# EAGLE design 17323^0 (EAGLE 7.6.0)
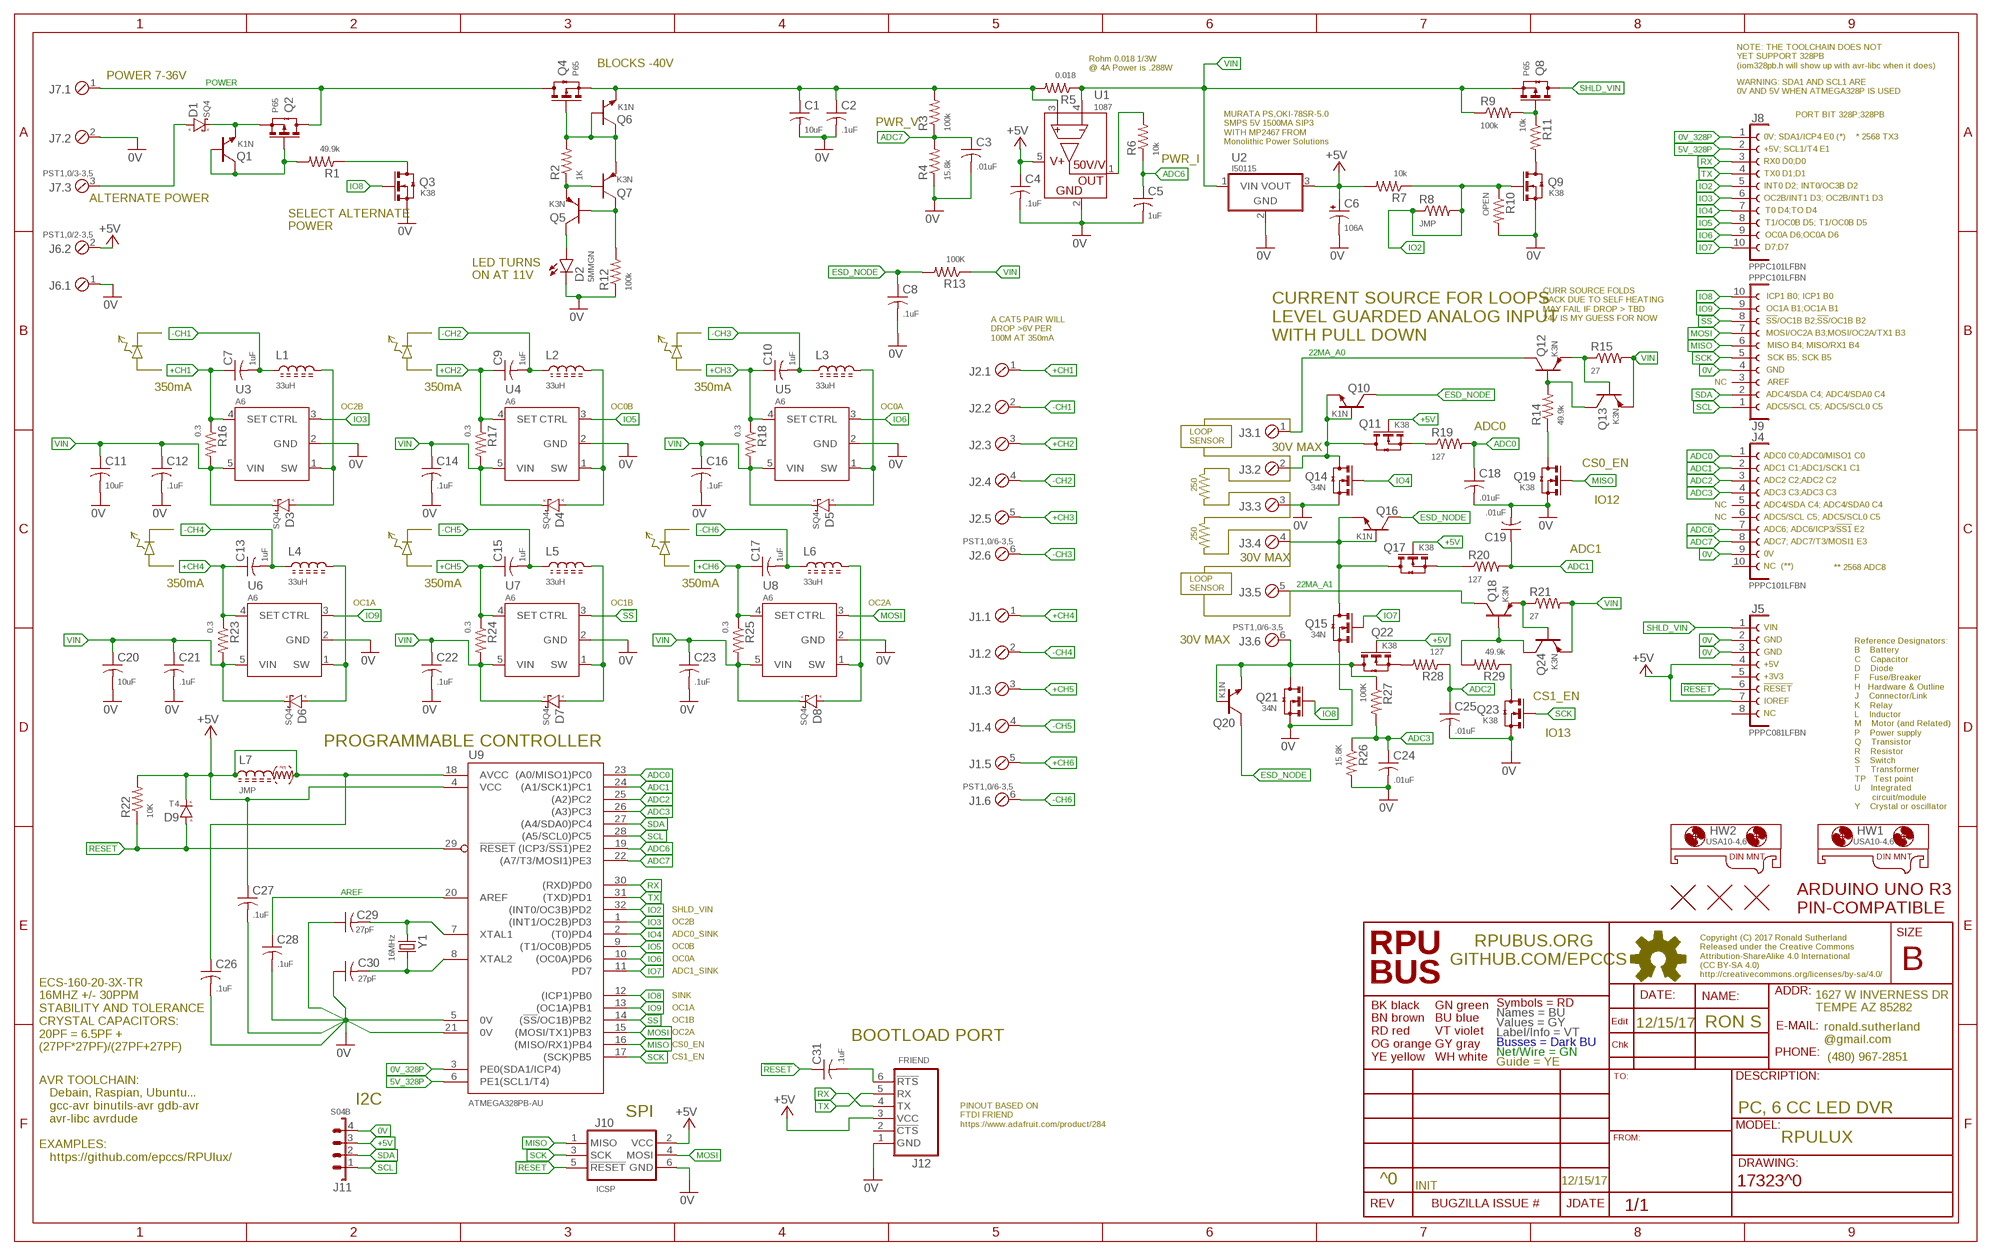
[diagram p0: schematic, sheet 1]

## Parts
C1  10uF  CC1206  [C1206(3216)]
C2  .1uF  CC0805A  [C0805(2012)]
C3  .01uF  CC0603A  [C0603(1608)]
C4  .1uF  CC0603A  [C0603(1608)]
C5  1uF  CC0805A  [C0805(2012)]
C6  106A  CT1206  [3216]
C7  1uF  CC0805A  [C0805(2012)]
C8  .1uF  CC0603A  [C0603(1608)]
C9  1uF  CC0805A  [C0805(2012)]
C10  1uF  CC0805A  [C0805(2012)]
C11  10uF  CC1206  [C1206(3216)]
C12  .1uF  CC0603A  [C0603(1608)]
C13  1uF  CC0805A  [C0805(2012)]
C14  .1uF  CC0603A  [C0603(1608)]
C15  1uF  CC0805A  [C0805(2012)]
C16  .1uF  CC0603A  [C0603(1608)]
C17  1uF  CC0805A  [C0805(2012)]
C18  .01uF  CC0603A  [C0603(1608)]
C19  .01uF  CC0603A  [C0603(1608)]
C20  10uF  CC1206  [C1206(3216)]
C21  .1uF  CC0603A  [C0603(1608)]
C22  .1uF  CC0603A  [C0603(1608)]
C23  .1uF  CC0603A  [C0603(1608)]
C24  .01uF  CC0603A  [C0603(1608)]
C25  .01uF  CC0603A  [C0603(1608)]
C26  .1uF  CC0603A  [C0603(1608)]
C27  .1uF  CC0603A  [C0603(1608)]
C28  .1uF  CC0603A  [C0603(1608)]
C29  27pF  CC0603A  [C0603(1608)]
C30  27pF  CC0603A  [C0603(1608)]
C31  .1uF  CC0603A  [C0603(1608)]
D1  SQ4  DSMA  [SMA]
D2  5MMGN  LED5MM  [LED5MM]
D3  SQ4  DSMA  [SMA]
D4  SQ4  DSMA  [SMA]
D5  SQ4  DSMA  [SMA]
D6  SQ4  DSMA  [SMA]
D7  SQ4  DSMA  [SMA]
D8  SQ4  DSMA  [SMA]
D9  T4  DSOD123  [SOD123]
HW1  USA10-4,6  MOUNT-HOLE5.0  [USA10]
HW2  USA10-4,6  MOUNT-HOLE5.0  [USA10]
J1  PST1,0/6-3,5  MCV6  [MCV6]
J2  PST1,0/6-3,5  MCV6  [MCV6]
J3  PST1,0/6-3,5  MCV6  [MCV6]
J4  PPPC101LFBN  F1X10  [F1X10]
J5  PPPC081LFBN  F1X8  [F1X8]
J6  PST1,0/2-3,5  MCV2  [MCV2]
J7  PST1,0/3-3,5  MCV3  [MCV3]
J8  PPPC101LFBN  F1X10  [F1X10]
J9  PPPC101LFBN  F1X10  [F1X10]
J10  ICSP  ISP-SPIPTH  [ISP]
J11  S04B  B04B  [B04B]
J12  FRIEND  [FRIEND]
L1  33uH  L2424  [L2424]
L2  33uH  L2424  [L2424]
L3  33uH  L2424  [L2424]
L4  33uH  L2424  [L2424]
L5  33uH  L2424  [L2424]
L6  33uH  L2424  [L2424]
L7  JMP  L0805  [C0805(2012)]
Q1  K1N  NPNSOT23  [SOT23]
Q2  P65  N-CHSOT23  [SOT23]
Q3  K38  N-CHSOT23  [SOT23]
Q4  P65  N-CHSOT23  [SOT23]
Q5  K3N  PNPSOT23  [SOT23]
Q6  K1N  NPNSOT23  [SOT23]
Q7  K3N  PNPSOT23  [SOT23]
Q8  P65  N-CHSOT23  [SOT23]
Q9  K38  N-CHSOT23  [SOT23]
Q10  K1N  NPNSOT23  [SOT23]
Q11  K38  N-CHSOT23  [SOT23]
Q12  K3N  PNPSOT23  [SOT23]
Q13  K3N  PNPSOT23  [SOT23]
Q14  34N  N-CHSOT23  [SOT23]
Q15  34N  N-CHSOT23  [SOT23]
Q16  K1N  NPNSOT23  [SOT23]
Q17  K38  N-CHSOT23  [SOT23]
Q18  K3N  PNPSOT23  [SOT23]
Q19  K38  N-CHSOT23  [SOT23]
Q20  K1N  NPNSOT23  [SOT23]
Q21  34N  N-CHSOT23  [SOT23]
Q22  K38  N-CHSOT23  [SOT23]
Q23  K38  N-CHSOT23  [SOT23]
Q24  K3N  PNPSOT23  [SOT23]
R1  49.9k  R0805  [C0805(2012)]
R2  1K  R0805  [C0805(2012)]
R3  100k  R0805  [C0805(2012)]
R4  15.8k  R0805  [C0805(2012)]
R5  0.018  R1210  [C1210(3225)]
R6  10k  R0805  [C0805(2012)]
R7  10k  R0805  [C0805(2012)]
R8  JMP  R0805  [C0805(2012)]
R9  100k  R0805  [C0805(2012)]
R10  OPEN  R0805  [C0805(2012)]
R11  10k  R0805  [C0805(2012)]
R12  100k  R0805  [C0805(2012)]
R13  100K  R0805  [C0805(2012)]
R14  49.9k  R0805  [C0805(2012)]
R15  27  R0805  [C0805(2012)]
R16  0.3  R1210  [C1210(3225)]
R17  0.3  R1210  [C1210(3225)]
R18  0.3  R1210  [C1210(3225)]
R19  127  R0805  [C0805(2012)]
R20  127  R0805  [C0805(2012)]
R21  27  R0805  [C0805(2012)]
R22  10K  R0805  [C0805(2012)]
R23  0.3  R1210  [C1210(3225)]
R24  0.3  R1210  [C1210(3225)]
R25  0.3  R1210  [C1210(3225)]
R26  15.8K  R0805  [C0805(2012)]
R27  100K  R0805  [C0805(2012)]
R28  127  R0805  [C0805(2012)]
R29  49.9k  R0805  [C0805(2012)]
U1  1087  ZXCT1087  [SOT23-5]
U2  I50115  OKI-78SR-H  [OKI-78SR-H]
U3  A6  AL8805  [SOT23-5]
U4  A6  AL8805  [SOT23-5]
U5  A6  AL8805  [SOT23-5]
U6  A6  AL8805  [SOT23-5]
U7  A6  AL8805  [SOT23-5]
U8  A6  AL8805  [SOT23-5]
U9  ATMEGA328PB-AU  [TQFP32-08]
U$1  ARDUINO-UNO  [ARDUINO_UNO]
U$2  FIDUCIAL1.27  [FIDUCIAL-1.27]
U$3  FIDUCIAL1.27  [FIDUCIAL-1.27]
U$4  FIDUCIAL1.27  [FIDUCIAL-1.27]
Y1  16MHz  CSM-3X  [CSM-3X]

## Nets
0V: C1.2 C2.2 C3.2 C4.2 C5.2 C6.- C8.2 C11.2 C12.2 C14.2 C16.2 C18.2 C19.2 C20.2 C21.2 C22.2 C23.2 C24.2 C25.2 C26.2 C27.2 C28.2 C29.1 C30.1 D2.K J3.3 J4.9 J5.2 J5.3 J6.1 J7.2 J9.4 J10.6(GND) J11.4 J12.1(GND) Q3.2(S)(S) Q9.2(S)(S) Q14.2(S)(S) Q15.2(S)(S) Q19.2(S)(S) Q21.2(S)(S) Q23.2(S)(S) R4.1 R10.2 R12.1 R26.2 U1.2(GND) U2.2(GND) U3.2(GND) U4.2(GND) U5.2(GND) U6.2(GND) U7.2(GND) U8.2(GND) U9.5(0V) U9.21(0V)
0V_328P: J8.1 U9.3(PE0(SDA1/ICP4))
5V_328P: J8.2 U9.6(PE1(SCL1/T4))
22MA_A0: J3.1 Q12.C
22MA_A1: J3.5 Q18.C
!RESET!: C31.1 D9.A J5.6 J10.5(!RESET) R22.1 U9.29(!RESET)
!SS: J9.8 U7.3(CTRL) U9.14((!SS!/OC1B)PB2)
+5V: C4.1 C6.+ C26.1 C27.1 D9.C(K) J5.4 J5.7 J6.2 J10.2(VCC) J11.3 J12.3(VCC) L7.1 L7.2 Q11.1(G)(G) Q17.1(G)(G) Q22.1(G)(G) R7.2 R22.2 U1.5(VCC) U2.3(VOUT) U9.4(VCC) U9.18(AVCC)
+CH1: C7.1 J2.1 R16.1 U3.4(SET)
+CH2: C9.1 J2.3 R17.1 U4.4(SET)
+CH3: C10.1 J2.5 R18.1 U5.4(SET)
+CH4: C13.1 J1.1 R23.1 U6.4(SET)
+CH5: C15.1 J1.3 R24.1 U7.4(SET)
+CH6: C17.1 J1.5 R25.1 U8.4(SET)
-CH1: C7.2 J2.2 L1.1
-CH2: C9.2 J2.4 L2.1
-CH3: C10.2 J2.6 L3.1
-CH4: C13.2 J1.2 L4.1
-CH5: C15.2 J1.4 L5.1
-CH6: C17.2 J1.6 L6.1
ADC0: C18.1 J4.1 R19.2 U9.23((A0/MISO1)PC0)
ADC1: C19.1 J4.2 R20.2 U9.24((A1/SCK1)PC1)
ADC2: C25.1 J4.3 R28.1 U9.25((A2)PC2)
ADC3: C24.1 J4.4 R26.1 R27.2 U9.26((A3)PC3)
ADC6: C5.1 J4.7 R6.1 U9.19((ICP3/!SS1!)PE2)
ADC7: C3.1 J4.8 R3.1 R4.2 U9.22((A7/T3/MOSI1)PE3)
AREF: C28.1 U9.20(AREF)
ESD_NODE: C8.1 Q10.C Q16.C Q20.C R13.2
IO2: J8.5 Q9.1(G)(G) R7.1 R8.1 R8.2 R10.1 U9.32((INT0/OC3B)PD2)
IO3: J8.6 U3.3(CTRL) U9.1((INT1/OC2B)PD3)
IO4: J8.7 Q14.1(G)(G) U9.2((T0)PD4)
IO5: J8.8 U4.3(CTRL) U9.9((T1/OC0B)PD5)
IO6: J8.9 U5.3(CTRL) U9.10((OC0A)PD6)
IO7: J8.10 Q15.1(G)(G) U9.11(PD7)
IO8: J9.10 Q3.1(G)(G) Q21.1(G)(G) U9.12((ICP1)PB0)
IO9: J9.9 U6.3(CTRL) U9.13((OC1A)PB1)
MISO: J9.6 J10.1(MISO) Q19.1(G)(G) U9.16((MISO/RX1)PB4)
MOSI: J9.7 J10.4(MOSI) U8.3(CTRL) U9.15((MOSI/TX1)PB3)
N$1: Q22.2(S)(S) R28.2
N$2: Q8.1(G)(G) R9.2 R11.1
N$3: D3.A L1.2 U3.1(SW)
N$4: Q9.3(D)(D) R11.2
N$5: Q5.B Q7.C R12.2
N$6: Q4.1(G)(G) Q6.B Q6.C Q7.E R2.2
N$7: D2.A Q5.C
N$8: R6.2 U1.1(OUT)
N$9: J3.6 Q20.B Q20.E Q21.3(D)(D) Q22.3(D)(D) R27.1
N$10: Q5.E Q7.B R2.1
N$11: D6.A L4.2 U6.1(SW)
N$12: J3.4 Q15.3(D)(D) Q16.B Q16.E Q17.3(D)(D)
N$13: Q17.2(S)(S) R20.1
N$14: Q11.2(S)(S) R19.1
N$15: J3.2 Q10.B Q10.E Q11.3(D)(D) Q14.3(D)(D)
N$16: D4.A L2.2 U4.1(SW)
N$17: D7.A L5.2 U7.1(SW)
N$18: D5.A L3.2 U5.1(SW)
N$19: Q23.3(D)(D) R29.1
N$20: Q12.E Q13.B R15.1
N$21: Q19.3(D)(D) R14.1
N$22: D8.A L6.2 U8.1(SW)
N$23: Q12.B Q13.C R14.2
N$24: D1.A J7.3
N$25: C31.2 J12.6(!RTS)
N$28: Q18.E Q24.B R21.1
N$29: Q18.B Q24.C R29.2
N$32: D1.K Q1.E Q2.2(S)(S)
N$33: Q1.B Q1.C Q2.1(G)(G) R1.2
N$34: Q3.3(D)(D) R1.1
N$115: C29.2 U9.7(XTAL1) Y1.1
N$116: C30.2 U9.8(XTAL2) Y1.2
POWER: J7.1 Q2.3(D)(D) Q4.3(D)(D)
RX: J8.3 J12.4(TX) U9.30((RXD)PD0)
SCK: J9.5 J10.3(SCK) Q23.1(G)(G) U9.17((SCK)PB5)
SCL: J9.1 J11.1 U9.28((A5/SCL0)PC5)
SDA: J9.2 J11.2 U9.27((A4/SDA0)PC4)
SHLD_VIN: J5.1 Q8.3(D)(D)
TX: J8.4 J12.5(RX) U9.31((TXD)PD1)
VIN: C11.1 C12.1 C14.1 C16.1 C20.1 C21.1 C22.1 C23.1 D3.K D4.K D5.K D6.K D7.K D8.K Q8.2(S)(S) Q13.E Q24.E R5.1 R9.1 R13.1 R15.2 R16.2 R17.2 R18.2 R21.2 R23.2 R24.2 R25.2 U1.4(S-) U2.1(VIN) U3.5(VIN) U4.5(VIN) U5.5(VIN) U6.5(VIN) U7.5(VIN) U8.5(VIN)
VIN_S: C1.1 C2.1 Q4.2(S)(S) Q6.E R3.2 R5.2 U1.3(S+)
Unconnected: J4.5 J4.6 J4.10 J5.5 J5.8 J9.3 J12.2(!CTS)

## Notes on the sheet
- BLOCKS -40V
- NOTE: THE TOOLCHAIN DOES NOT 
  YET SUPPORT 328PB
  (iom328pb.h will show up with avr-libc when it does)
- Rohm 0.018 1/3W
  @ 4A Power is .288W
- POWER 7-36V
- WARNING: SDA1 AND SCL1 ARE 
  0V AND 5V WHEN ATMEGA328P IS USED
- PORT BIT 328P;328PB
- PWR_V
- 0V; SDA1/ICP4 E0 (*) | * 2568 TX3
- MURATA PS,OKI-78SR-5.0
  SMPS 5V 1500MA SIP3
  WITH MP2467 FROM 
  Monolithic Power Solutions
- +5V; SCL1/T4 E1
- PWR_I | RX0 D0;D0
- TX0 D1;D1
- INT0 D2; INT0/OC3B D2
- ALTERNATE POWER | OC2B/INT1 D3; OC2B/INT1 D3
- T0 D4;TO D4
- T1/OC0B D5; T1/OC0B D5
- SELECT ALTERNATE
  POWER
- OC0A D6;OC0A D6
- D7;D7
- LED TURNS 
  ON AT 11V
- ICP1 B0; ICP1 B0
- OC1A B1;OC1A B1
- CURR SOURCE FOLDS 
  BACK DUE TO SELF HEATING 
  MAY FAIL IF DROP > TBD 
  24V IS MY GUESS FOR NOW
- !SS!/OC1B B2;!SS!/OC1B B2
- MOSI/OC2A B3;MOSI/OC2A/TX1 B3
- A CAT5 PAIR WILL
  DROP >6V PER 
  100M AT 350mA
- CURRENT SOURCE FOR LOOPS
  LEVEL GUARDED ANALOG INPUT 
  WITH PULL DOWN
- MISO B4; MISO/RX1 B4
- SCK B5; SCK B5
- GND
- NC | AREF
- 350mA | 350mA | 350mA
- ADC4/SDA C4; ADC4/SDA0 C4
- OC2B | OC0B | OC0A | ADC5/SCL C5; ADC5/SCL0 C5
- ADC0
- LOOP 
  SENSOR
- 30V MAX
- ADC0 C0;ADC0/MISO1 C0
- CS0_EN
- ADC1 C1;ADC1/SCK1 C1
- ADC2 C2;ADC2 C2
- 250
- ADC3 C3;ADC3 C3
- IO12
- NC | ADC4/SDA C4; ADC4/SDA0 C4
- NC | ADC5/SCL C5; ADC5/SCL0 C5
- ADC6; ADC6/ICP3/!SS1! E2
- 250
- ADC7; ADC7/T3/MOSI1 E3
- ADC1
- 0V
- 30V MAX
- NC  (**) | ** 2568 ADC8
- 350mA | 350mA | 350mA
- LOOP 
  SENSOR
- OC1A | OC1B | OC2A
- VIN
- 30V MAX | GND
- GND
- +5V
- +3V3
- !RESET
- CS1_EN
- IOREF
- NC
- IO13
- PROGRAMMABLE CONTROLLER
- SHLD_VIN
- OC2B
- ADC0_SINK
- OC0B
- OC0A
- ADC1_SINK
- SINK
- OC1A
- OC1B
- 12/15/17 | RON S
- OC2A
- BOOTLOAD PORT
- CS0_EN
- ECS-160-20-3X-TR
  16MHZ +/- 30PPM
  STABILITY AND TOLERANCE
  CRYSTAL CAPACITORS:
  20PF = 6.5PF +
  (27PF*27PF)/(27PF+27PF)
- CS1_EN
- I2C
- SPI | PC, 6 CC LED DVR
- PINOUT BASED ON
  FTDI FRIEND
  https://www.adafruit.com/product/284
- RPULUX
- AVR TOOLCHAIN: 
     Debain, Raspian, Ubuntu...
     gcc-avr binutils-avr gdb-avr 
     avr-libc avrdude
  
  EXAMPLES:
     https://github.com/epccs/RPUlux/
- ^0 | 12/15/17
- INIT

## Library data of the parts
C1-C5 C7-C31 = C-C:C: CAPACITOR Symbol
C6 = C-T:CT: Tantalum Electrolytic Capacitor
D1 D3-D8 = D-SBR:D: DIODE
D2 = D-LED:LED: LED 120120WH [CREE,XHGAWT-00-0000-00000HXE1] LED WHITE 6500K 150LUM-W120120
D9 = D-GP:D: DIODE
HW1 HW2 = HW-DINMnt:MOUNT-HOLE: USA10-4.6 [PhxCont,1202713] DINRAIL ADAPTER UNIVERSAL 10MM 4.6MM
J1-J3 = J-HDR3.5mm:MCV6: MCV 1,5/6-G-3,5 [PHOENIX CONTACT,1843648] CONN HEADER SHROUDED 6POS 3.5MM MCVR 1,5/6-ST-3,5 [PHOENIX CONTACT,1863194] CONN PLUG 6POS SCREW 3.5MM PST 1,0/6-3,5 [PHOENIX CONTACT,1945135] CONN HEADER STRIP PIN 6POS 3.5MM PT 1,5/6-PVH-3,5 [PHOENIX CONTACT,1984057] CONN PLUG STRIP 6POS 3.5MM Drill Size 3/64": .0469" (1.2mm)
J4 J8 J9 = J-HDR2.54mm:F1X10: FEMALE HEADER 10POS
J5 = J-HDR2.54mm:F1X8: FEMALE HEADER 8POS
J6 = J-HDR3.5mm:MCV2: MCV 1,5/ 2-G-3,5-RN [PHOENIX CONTACT,1731471] CONN HEADER SHROUDED 2POS 3.5MM MCVR 1,5/ 2-ST-3,5 [PHOENIX CONTACT,1863152] CONN PLUG 2POS SCREW 3.5MM PST 1,0/2-3,5 [PHOENIX CONTACT,1945096] CONN HEADER STRIP PIN 2POS 3.5MM PT1,5/2-PVH-3,5 [PHOENIX CONTACT,1984015] CONN PLUG STRIP 2POS 3.5MM
J7 = J-HDR3.5mm:MCV3: MCV 1,5/ 3-G-3,5-RN [PHOENIX CONTACT,1731484] CONN HEADER SHROUDED 3POS 3.5MM MCVR 1,5/ 3-ST-3,5 [PHOENIX CONTACT,1863165] CONN PLUG 3POS SCREW 3.5MM PST 1,0/3-3,5 [PHOENIX CONTACT,1945106] CONN HEADER STRIP PIN 3POS 3.5MM PT1,5&3-PVH-3,5 [PHOENIX CONTACT,1984028] CONN PLUG STRIP 3POS 3.5MM
J10 = U-AVR:ISP-SPI: AVR ISP thru SPI In-System Programming uses the target Atmel AVR’s internal SPI (Serial Peripheral Interface) to download code into the flash and EEPROM memories. It is not a debugging interface. When designing an application PCB which includes an AVR with the SPI interface, this pinout should be used. Sparkfun SKU: BOB-08508
J11 = J-HDR2mm:B04B: B04B [JST@B04B-PASK] CONN HEADER VERT THRU 4POS S04B [JST@S04B-PASK] CONN HEADER SIDE THRU 4POS
J12 = U-AVR:FRIEND: used for serial interfaces and serial bootloaders optiboot does not read the fuse but reports as they should be. It also erases chip. avrdude -c arduino -v -p atmega328p -P /dev/ttyUSB0 -b 115200 -U flash:w:BlinkLED.hex xboot use -e to erase chip, and -u to disable fuse checks since bootloaders can't see them. avrdude -c avr109 -v -p atmega1284p -P /dev/ttyUSB0 -b 115200 -e -u -U flash:w:BlinkLED.hex Arduino uses the nRTS (or nDTR) negative going edge to start the bootloader by causing a reset on the MCU.
L1-L6 = L-PWR:L: Inductor
L7 = L-FB:L: Ferrite Bead with frequency dependent resistance
Q1 Q6 Q10 Q16 Q20 = Q-NPN:NPN: BJT NPN General Purpose Amplifier
Q2 Q4 Q8 = Q-PCH:N-CH?*: ENHANCEMENT MODE MOSFET SOT23 is BSS138 pinout
Q3 Q9 Q11 Q14 Q15 Q17 Q19 Q21-Q23 = Q-NCH:N-CH?*: ENHANCEMENT MODE MOSFET SOT23 is BSS138 pinout
Q5 Q7 Q12 Q13 Q18 Q24 = Q-PNP:PNP: BJT NPN General Purpose Amplifier
R1-R29 = R-C:R: Resiistor American-style symbol
U1 = U-Linear:ZXCT1087: 1087 [DIODES,ZXCT1087E5TA] HISIDE CURRENT MONITOR SOT23-5
U2 = P-DCDC:OKI-78SR: OKI-78SR OKI-78SR-5/1.5-W36H-C 5V@1.5A Horizontal Mount OKI-78SR-5/1.5-W36-C 5V@1.5A Vert Mount OKI-78SR-3.3/1.5-W36H-C 3.3V@1.5A Horizontal Mount OKI-78SR-3.3/1.5-W36-C 3.3V@1.5A Vert Mount Murata Power Solutions 7 to 36 VDC input range need to verify pinout
U3-U8 = U-Linear:AL8805: A6 [DIODES,AL8805W5-7] CURR DRIVER SOT23-5
U9 = U-AVR:ATMEGA328PB-AU: ATmega328PB 4 Kbytes FLASH 128 bytes SRAM 256 bytes EEPROM 2 UART, 2 I2C, 2 SPI 8-channel 10 bit ADC
U$1 = J-BoardHDR:ARDUINO-UNO: Board Outline with holes and silk note the board dim layer is not defined
U$2-U$4 = H-Fiducial:FIDUCIAL: Fiducial Alignment Points Various fiducial points for machine vision alignment.
Y1 = Y-XTL:CSM: 16MHZ20 [ECS,ECS-160-20-3X-TR] CRYSTAL 16MHZ 20PF 30PPM CSM-3X

## Net classes
0 default: width 0.178 mm, drill 0.33 mm

## Board
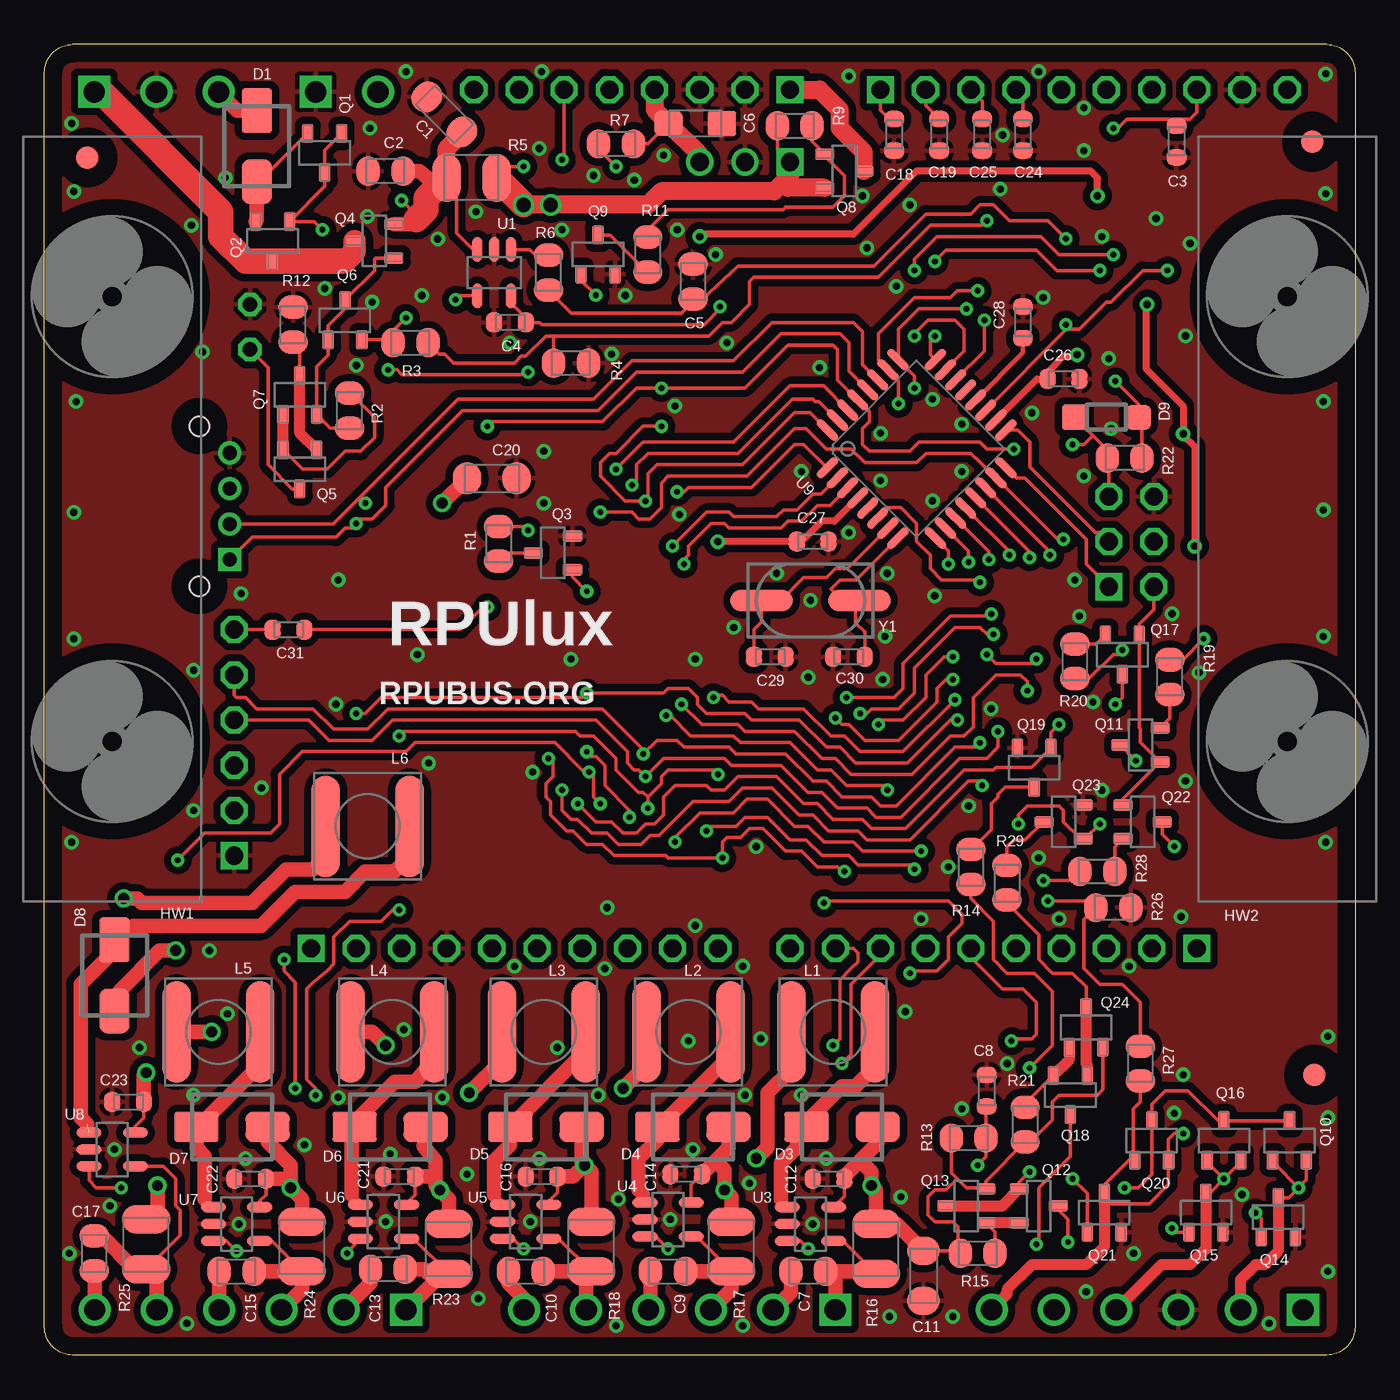
[diagram p1: board, top side]
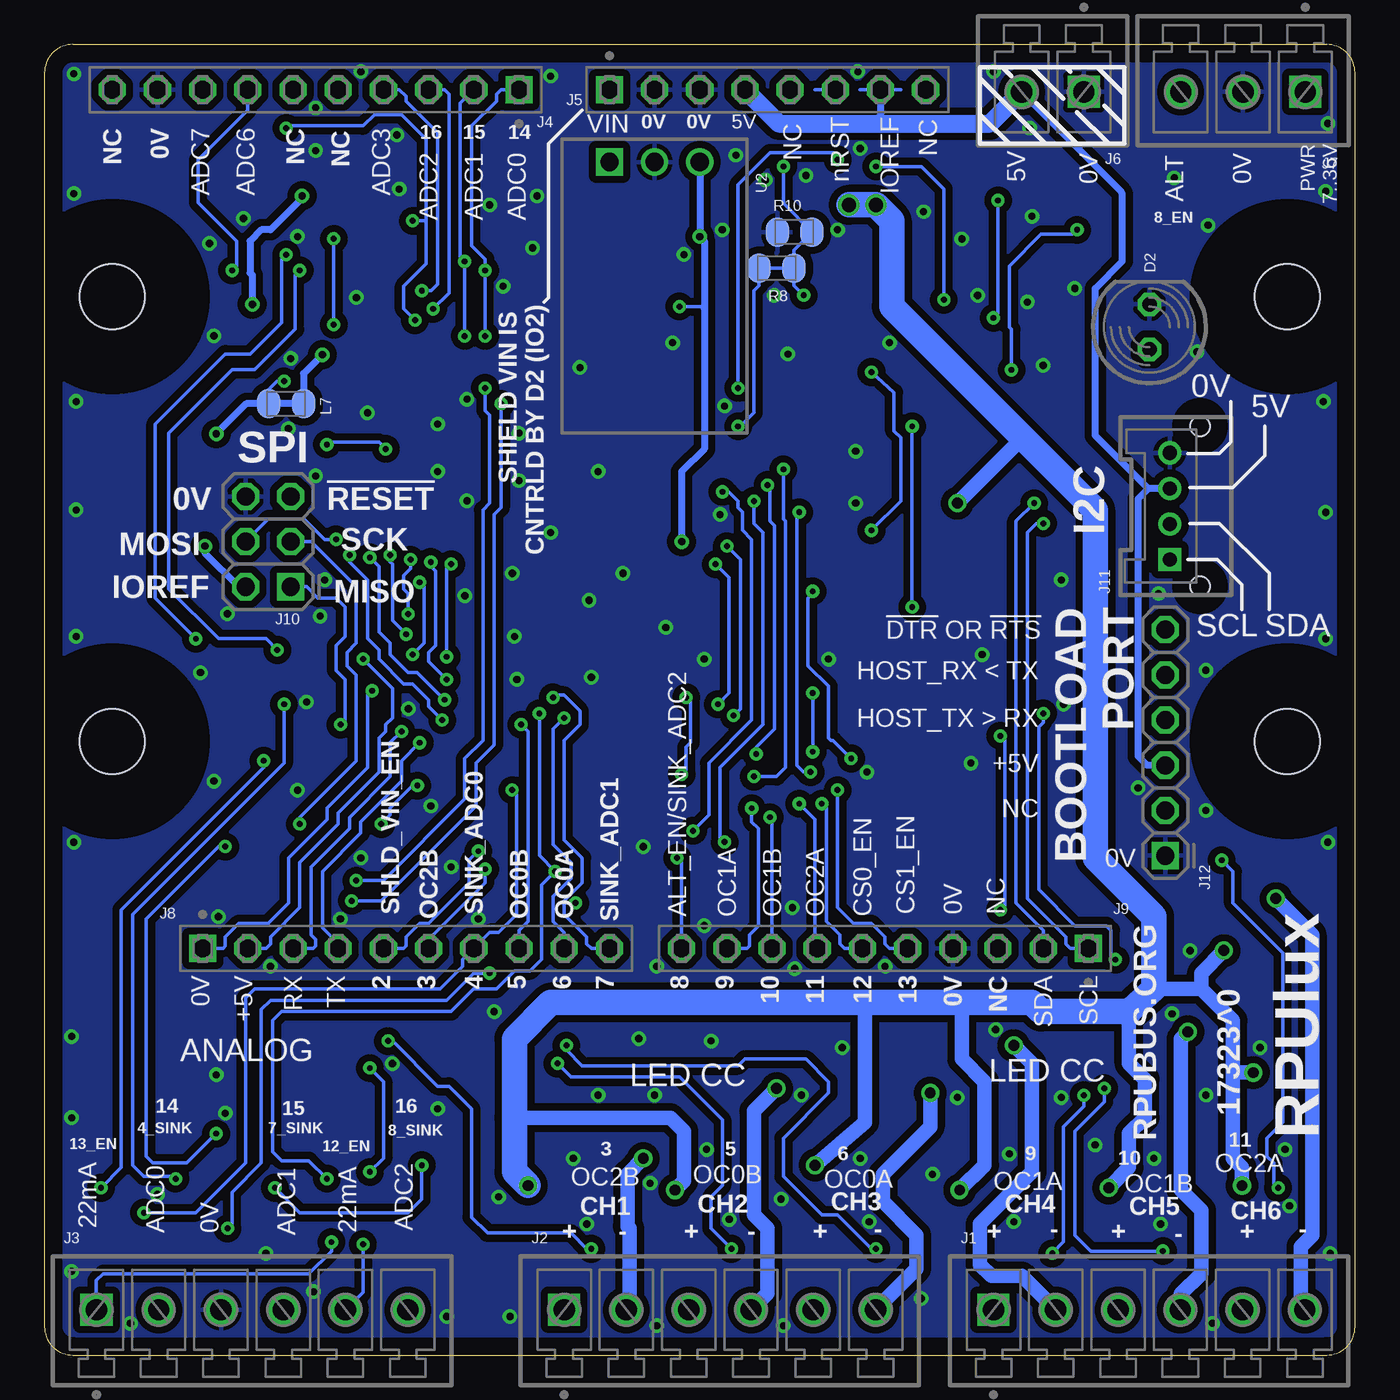
[diagram p2: board, bottom side, seen from below]

Size 73.66 x 73.66 mm. Coordinates in mm from the lower left corner, seen from the top.
Outline: 73.66,72.07 73.66,1.59 arc-90 72.07,0 1.59,0 arc-90 0,1.59 0,72.07 arc-90 1.59,73.66 72.07,73.66 arc-90 73.66,72.07
Copper layers (1*16): Top 0.034290625mm / dielectric 60mil / Bottom 0.034290625mm
Design rules "default *": minimum track width 7mil, minimum drill 13mil, track to track 12mil, track to pad 10mil, pad to pad 8mil, via to via 12mil, smd to smd 8mil, copper to edge 40mil, drill to drill 16mil, minimum pad ring 10mil, minimum via ring 8mil, stop-mask expansion 4mil, vias tented up to drill 17mil, thermal gap 10mil

### Footprints (pad centres in the part's own frame; a part is rotated, then mirrored left to right if it is on the bottom)
C1206(3216) = smd 1.6 x 1.8: 1 -1.4,0; 2 1.4,0
C0805(2012) = smd 1.321 x 1.651: 1 -0.977,0; 2 0.977,0
C0603(1608) = smd 0.898 x 1.1: 1 -0.889,0; 2 0.889,0
3216 = smd 1.6 x 1.4: + -1.5,0; - 1.5,0
SMA = smd 2.5 x 1.7: A 2,0; K -2,0
LED5MM = drill 0.813 octagon: A -1.27,0; K 1.27,0
SOD123 = smd 1.4 x 1.4: A 1.8,0; C -1.8,0
USA10 = hole 3.658: -12.5,0; 12.5,0
MCV6 = drill 1.2 square: 1 0,0 | drill 1.2: 2 3.5,0; 3 7,0; 4 10.5,0; 5 14,0; 6 17.5,0
F1X10 = drill 1.016 square: 1 0,0 | drill 1.016 octagon: 2 2.54,0; 3 5.08,0; 4 7.62,0; 5 10.16,0; 6 12.7,0; 7 15.24,0; 8 17.78,0; 9 20.32,0; 10 22.86,0
F1X8 = drill 1.016 square: 1 0,0 | drill 1.016 octagon: 2 2.54,0; 3 5.08,0; 4 7.62,0; 5 10.16,0; 6 12.7,0; 7 15.24,0; 8 17.78,0
MCV2 = drill 1.2 square: 1 0,0 | drill 1.2: 2 3.5,0
MCV3 = drill 1.2 square: 1 0,0 | drill 1.2: 2 3.5,0; 3 7,0
ISP = drill 1.016 square: 1 0,0 | drill 1.016 octagon: 2 0,2.54; 3 2.54,0; 4 2.54,2.54; 5 5.08,0; 6 5.08,2.54
B04B = drill 0.8 square: 1 0,0 | drill 0.8: 2 2,0; 3 4,0; 4 6,0 | hole 1.1: 7.5,-1.7; -1.5,-1.7
FRIEND = drill 1.016 square: 1 0,0 | drill 1.016 octagon: 2 2.54,0; 3 5.08,0; 4 7.62,0; 5 10.16,0; 6 12.7,0
L2424 = smd 1.6 x 5.7: 1 2.35,0; 2 -2.35,0
SOT23 = smd 0.65 x 1.06: B -0.95,-1.1; C 0,1.1; E 0.95,-1.1
SOT23' = smd 0.65 x 1.06: 1(G) -0.95,-1.1; 2(S) 0.95,-1.1; 3(D) 0,1.1
C1210(3225) = smd 1.6 x 2.7: 1 -1.4,0; 2 1.4,0
SOT23-5 = smd 0.55 x 1.4: 1 -0.95,-1.3; 2 0,-1.3; 3 0.95,-1.3; 4 0.95,1.3; 5 -0.95,1.3
OKI-78SR-H = drill 1.016 square: 1 0,0 | drill 1.016: 2 -2.54,0; 3 -5.08,0
TQFP32-08 = smd 1.5 x 0.45: 1 -4.293,2.8; 2 -4.293,2; 3 -4.293,1.2; 4 -4.293,0.4; 5 -4.293,-0.4; 6 -4.293,-1.2; 7 -4.293,-2; 8 -4.293,-2.8; 17 4.293,-2.8; 18 4.293,-2; 19 4.293,-1.2; 20 4.293,-0.4; 21 4.293,0.4; 22 4.293,1.2; 23 4.293,2; 24 4.293,2.8 | smd 0.45 x 1.5: 9 -2.8,-4.293; 10 -2,-4.293; 11 -1.2,-4.293; 12 -0.4,-4.293; 13 0.4,-4.293; 14 1.2,-4.293; 15 2,-4.293; 16 2.8,-4.293; 25 2.8,4.293; 26 2,4.293; 27 1.2,4.293; 28 0.4,4.293; 29 -0.4,4.293; 30 -1.2,4.293; 31 -2,4.293; 32 -2.8,4.293
FIDUCIAL-1.27 = smd 1.27 x 1.27: 1 0,0
CSM-3X = smd 3.5 x 1.2: 1 -2.75,0; 2 2.75,0

### Placement (x,y rotation side)
C1  22.48,69.72 135 top
C2  19.18,66.55 180 top
C3  63.63,68.2 270 top
C4  26.16,58.04 180 top
C5  36.45,60.33 90 top
C6  36.58,69.22 0 top
C7  42.93,4.7 180 top
C8  52.96,14.86 90 top
C9  35.05,4.7 180 top
C10  27.05,4.7 180 top
C11  49.4,4.45 270 top
C12  44.07,9.91 180 top
C13  19.3,4.83 180 top
C14  36.07,10.16 180 top
C15  10.79,4.7 180 top
C16  27.94,10.03 180 top
C17  2.79,5.71 270 top
C18  47.75,68.58 270 top
C19  50.29,68.58 270 top
C20  25.15,49.28 0 top
C21  19.94,10.03 180 top
C22  11.56,9.91 180 top
C23  4.7,14.22 180 top
C24  54.99,68.58 270 top
C25  52.7,68.58 270 top
C26  57.28,54.86 0 top
C27  43.18,45.72 0 top
C28  54.99,58.04 90 top
C29  40.77,39.24 180 top
C30  45.21,39.24 0 top
C31  13.72,40.77 180 top
D1  11.94,67.94 90 top
D2  11.56,57.78 90 bottom
D3  44.83,12.83 180 top
D4  36.45,12.83 180 top
D5  28.19,12.83 180 top
D6  19.43,12.83 180 top
D7  10.54,12.83 180 top
D8  3.94,21.34 90 top
D9  59.69,52.7 180 top
HW1  3.81,46.99 90 top
HW2  69.85,46.99 90 top
J1  20.32,2.54 0 bottom
J2  44.45,2.54 0 bottom
J3  70.74,2.54 0 bottom
J4  46.99,71.12 180 bottom
J5  41.91,71.12 0 bottom
J6  15.24,70.99 180 bottom
J7  2.79,70.99 180 bottom
J8  64.77,22.86 0 bottom
J9  14.99,22.86 180 bottom
J10  59.82,43.18 90 bottom
J11  10.41,44.7 90 bottom
J12  10.67,28.07 90 bottom
L1  44.32,18.16 180 top
L2  36.2,18.16 180 top
L3  28.07,18.16 180 top
L4  19.56,18.16 180 top
L5  9.78,18.16 180 top
L6  18.16,29.72 180 top
L7  60.07,53.47 180 bottom
Q1  15.75,67.56 180 top
Q2  P65  [SOT23']  12.83,62.61 180 top
Q3  K38  [SOT23']  28.57,45.09 90 top
Q4  P65  [SOT23']  18.54,62.61 90 top
Q5  14.35,49.78 180 top
Q6  16.89,58.17 0 top
Q7  14.35,53.98 0 top
Q8  P65  [SOT23']  44.96,66.55 270 top
Q9  K38  [SOT23']  31.11,61.85 0 top
Q10  69.98,12.06 0 top
Q11  K38  [SOT23']  61.59,34.29 90 top
Q12  55.88,8.38 270 top
Q13  51.82,8.38 90 top
Q14  34N  [SOT23']  69.34,7.75 0 top
Q15  34N  [SOT23']  65.28,8 0 top
Q16  66.29,12.06 0 top
Q17  K38  [SOT23']  60.58,39.37 180 top
Q18  57.66,14.61 180 top
Q19  K38  [SOT23']  55.63,33.02 180 top
Q20  62.23,12.06 0 top
Q21  34N  [SOT23']  59.56,8 0 top
Q22  K38  [SOT23']  61.72,29.97 270 top
Q23  K38  [SOT23']  57.28,29.97 90 top
Q24  58.55,18.41 0 top
R1  25.53,45.59 90 top
R2  17.14,53.09 270 top
R3  20.57,56.9 180 top
R4  29.59,55.75 180 top
R5  24,66.17 180 top
R6  28.32,60.83 90 top
R7  32.13,68.07 0 top
R8  32.51,61.09 0 bottom
R9  42.16,69.09 0 top
R10  31.5,63.12 180 bottom
R11  33.91,61.85 270 top
R12  13.97,57.91 270 top
R13  51.94,12.19 0 top
R14  52.07,27.43 270 top
R15  52.45,5.71 180 top
R16  46.74,5.97 90 top
R17  38.61,6.1 90 top
R18  30.73,6.1 90 top
R19  63.25,38.1 90 top
R20  57.91,38.99 270 top
R21  55.12,12.95 270 top
R22  60.71,50.42 0 top
R23  22.73,5.97 90 top
R24  14.48,6.1 90 top
R25  5.71,6.22 90 top
R26  60.07,25.15 0 top
R27  61.59,16.38 90 top
R28  59.18,27.18 0 top
R29  54.1,26.54 270 top
U1  25.27,60.83 180 top
U2  41.91,67.06 180 bottom
U3  43.05,7.37 270 top
U4  35.05,7.62 270 top
U5  27.05,7.49 270 top
U6  19.05,7.49 270 top
U7  10.79,7.37 270 top
U8  3.81,11.56 270 top
U9  49.02,50.93 45 top
U$1  -3.81,73.66 180 bottom  (outside the outline)
U$2  71.25,68.2 0 top
U$3  2.41,67.31 0 top
U$4  71.37,15.75 0 top
Y1  43.05,42.42 0 top

### Tracks (layer width: path | path; a pad name or v marks a point on that pad's centre or on a via)
0V  (via drill 0.41)
  other vias: 72.14,13.34 51.94,30.86 59.82,56.01 56.13,59.44 29.59,39.12 57.91,43.56 31.62,25.15 20.32,72.14 27.94,72.14 48.64,64.64 64.39,62.48 1.4,5.71 49.91,53.72 53.72,65.53 59.44,62.87 37.72,61.85 45.97,65.15 45.21,71.88 35.56,63.25 49.91,48.01 51.56,49.66 46.99,51.82 58.42,67.69 58.42,70.1 55.88,72.14 72.01,72.01 72.01,65.28 71.88,53.59 71.88,47.5 71.88,40.39 72.01,28.83 61.21,5.71 72.14,17.91 59.44,31.75 34.8,67.44 30.86,66.29 33.15,66.04 47.37,43.94 38.73,40.89 43.05,42.42 47.24,40.39 45.21,46.23 41.15,43.94 42.55,49.66 24.26,64.26 1.65,65.41 1.52,69.22 8.26,63.5 8.89,56.39 1.78,53.59 1.65,47.37 1.65,40.26 8.38,38.48 8.38,30.61 1.52,28.83 58.17,41.53 63.37,41.66 58.42,49.4 59.94,52.07 55.5,52.96 11.05,42.8 31.88,56.26 46.23,62.23 47.88,60.07 42.93,38.1 47.12,37.97 35.43,53.34 43.56,55.5 40.01,28.57 36.58,24.13 72.14,4.7 68.83,1.78 63.88,24.64 58.55,3.56 47.5,2.16 8,1.78 53.21,36.32 27.43,32.77 60.96,21.84 53.85,68.58 32.64,59.56 27.81,67.82 18.41,59.18 18.29,68.96 38.35,56.9 46.99,49.15 51.56,52.32 50.04,42.67 36.58,39.12 57.02,24.51 55.88,27.94 63.5,13.59 67.31,9.02 51.56,13.84 43.94,11.05 43.18,7.37 35.18,7.62 39.37,14.61 42.55,14.61 39.62,9.65 48.13,8.89 36.45,11.56 31.11,14.61 27.81,11.05 27.3,7.49 32.26,8.76 32.13,1.65 39.24,1.65 51.05,2.16 3.94,11.56 5.33,17.27 8.38,14.61 20.19,18.29 10.92,7.37 19.18,7.49 16.51,14.48 3.68,8.38 14.61,11.81 11.3,11.05 9.27,22.73 10.29,19.18 19.43,11.3 23.75,10.16 24.38,3.17 22.35,14.48 28.83,17.27 26.42,21.84 31.5,21.72 39.24,21.84 36.2,17.65 40.26,17.78 48.39,19.3 49.28,24.51 17.53,55.63 21.21,59.56 35.69,47.24 16.38,36.58 20.95,39.37 50.8,27.43 12.19,31.88 54.1,16.38 64.01,15.75 29.08,63.25 21.59,33.27 16.51,43.56 28.07,50.8 28.07,47.88 10.16,66.17 18.16,64.01 22.1,62.74 58.93,36.7 64.14,32.26 64.9,38.35 62.48,63.88 64.14,57.28 26.16,56.9 15.75,59.94
  pour Bottom (isolate 0.406): 0,73.66 73.66,73.66 73.66,0 0,0
  pour Top (isolate 0.406, rank 6): 0,73.66 73.66,73.66 73.66,0 0,0
0V_328P  (via drill 0.33)
  Top 0.203: U9.3 44.15,47.75 43.43,47.75 42.55,46.86 41.78,46.86 41.4,46.48 38.48,46.48 38.23,46.74 37.47,46.74 36.2,45.47 36.2,44.96 35.94,44.7 v35.94,44.45 | v35.81,36.58 36.96,35.43 38.99,35.43 39.37,35.05 42.16,35.05 43.69,33.53 44.45,33.53 45.34,32.64 48.77,32.64 50.93,34.8 51.69,34.8 52.2,35.31 52.2,36.96 53.47,38.23 54.86,38.23 55.24,37.85 v55.24,37.34
  Bottom 0.203: v35.81,36.58 35.18,37.21 35.18,43.69 v35.94,44.45 | J8.1 63.63,22.86 63.5,22.99 63.5,23.5 62.74,24.26 61.09,24.26 59.94,25.4 59.94,27.94 57.78,30.1 57.78,30.73 55.5,33.02 55.5,37.08 v55.24,37.34
5V_328P  (via drill 0.33)
  Top 0.203: U9.6 47.42,47.62 48.13,47.62 49.02,46.74 49.02,45.72 49.78,44.96 49.78,44.2 50.42,43.56 52.45,43.56 v52.58,43.43 | v52.96,39.37 53.47,38.86 55.5,38.86 v55.75,39.12
  Bottom 0.203: v52.58,43.43 52.32,43.18 52.32,40.01 v52.96,39.37 | v55.75,39.12 54.1,37.47 54.1,35.81 54.48,35.43 54.48,35.05 54.86,34.67 54.86,32.77 57.15,30.48 57.15,29.84 59.31,27.69 59.31,25.15 60.96,23.5 60.96,23.11 61.21,22.86 J8.2
22MA_A0  (via drill 0.33)
  Top 0.203: Q12.C 56.98,8.17 57.53,7.62 v57.53,6.35
  Bottom 0.203: v57.53,6.35 57.53,5.84 58.8,4.57 70.36,4.57 70.74,4.19 J3.1
22MA_A1  (via drill 0.33)
  Top 0.203: v55.75,6.22 55.88,6.35 55.88,9.4 57.66,11.18 Q18.C
  Bottom 0.203: v55.75,6.22 55.75,3.53 J3.5
!RESET!  (via drill 0.33)
  Top 0.203: v54.48,50.93 52.96,50.93 52.58,51.31 49.15,51.31 48.64,50.8 46.35,50.8 45.97,51.18 45.97,52.07 46.35,52.45 46.35,53.03 U9.29 44.58,54.81 44.58,56.52 44.32,56.77 41.78,56.77 39.37,54.36 v34.67,54.36 33.27,54.36 31.37,52.45 25.15,52.45 v24.89,52.2 | v29.08,67.18 29.21,67.31 J5.6 | J10.5 59.82,50.46 R22.1 59.73,50.87 58.92,51.68 | 58.92,51.68 D9.A | v57.78,51.18 58.42,51.18 58.92,51.68 | v24.89,42.04 24.64,42.04 23.37,40.77 C31.1
  Bottom 0.203: v57.78,51.18 57.66,51.31 54.86,51.31 v54.48,50.93 | v34.67,54.36 34.67,65.79 32.89,67.56 29.34,67.56 v29.08,67.18 | J5.6 30.35,71.12 | v24.89,52.2 v24.89,42.04
!SS  (via drill 0.33)
  Top 0.203: U9.14 56.52,45.13 v56.52,44.96 | v51.31,35.69 50.93,35.69 48.51,33.27 45.59,33.27 44.7,34.16 43.94,34.16 42.42,35.69 39.75,35.69 39.37,36.07 37.21,36.07 36.7,36.58 36.7,36.96 36.2,37.47 35.05,37.47 34.8,37.21 v30.48,37.21 30.23,36.96 18.92,36.96 18.03,36.07 v17.53,36.07 | v32.89,30.23 32.89,30.61 31.5,32 31.5,33.15 30.99,33.66 30.73,33.66 v30.48,33.91 | U7.3 10.22,6.42 v10.79,5.84 | v14.1,14.99 14.1,20.95 13.46,21.59 v13.46,22.23
  Bottom 0.203: v56.52,44.96 56.52,44.58 55.5,43.56 55.5,40.26 54.86,39.62 54.86,39.12 53.47,37.72 52.96,37.72 52.07,36.83 52.07,36.45 v51.31,35.69 | v32.89,30.23 32.77,30.1 J9.8 | v30.48,33.91 v30.48,37.21 | v10.79,5.84 14.86,5.84 15.75,6.73 15.75,12.57 14.1,14.22 v14.1,14.99 | v13.46,22.23 13.72,22.48 13.72,23.88 13.97,24.13 15.75,24.13 17.78,26.16 17.78,35.31 17.53,35.56 v17.53,36.07
+5V  (via drill 0.33, 0.41)
  Top 0.203: R7.2 33.93,68.07 C6.+ | R22.2 61.68,52.51 D9.C 61.49,53.45 v60.2,54.74 | J10.2 62.36,41.91 61.53,41.08 Q17.1(G) 61.53,35.24 61.59,35.18 61.59,34.44 Q11.1(G) 60.62,31.27 Q22.1(G) | U1.5 26.22,59.12 27.05,58.29 C4.1 27.81,58.04 27.94,57.91 37.08,57.91 37.97,58.8 v37.97,58.93
  Top 0.406: v59.18,65.15 59.18,66.17 58.8,66.55 49.02,66.55 45.47,62.99 36.96,62.99 v36.83,62.87 | U9.4 44.39,46.86 43.69,46.86 42.55,45.72 C27.1 v37.85,45.72 | v64.64,45.47 64.64,51.05 64.01,51.69 v64.01,51.78 64.01,53.34 61.94,55.41 61.94,59.02 v61.98,59.05 | U9.18 55.79,54.86 C26.1 56.39,55.24 57.28,56.13 57.95,56.13 v58.04,56.22
  Top 1.016: U2.3 36.83,67.46 C6.+ 34.29,70 J5.4
  Bottom 0.203: v60.2,54.74 60.58,54.74 61.05,54.27 L7.2 | 27.81,71.12 J5.7 25.53,71.12 | v37.97,58.93 36.7,58.93 36.58,58.8
  Bottom 0.406: v37.85,45.72 37.85,49.66 36.58,50.93 36.58,58.8 36.58,62.61 v36.83,62.87 U2.3 | v59.18,65.15 59.18,65.02 60.96,63.25 61.47,63.25 62.1,62.61 62.1,60.83 61.98,60.71 v61.98,59.05 | 26.8,69.22 26.67,69.34 J5.7 | J11.3 11.62,48.7 | v64.64,45.47 64.64,45.09 62.74,43.18 J10.2 | v64.01,51.78 62.32,53.47 L7.2 L7.1 59.09,55.17 v58.04,56.22 | 11.62,48.7 14.61,51.69 14.61,59.94 13.08,61.47 13.08,65.28 13.15,65.41 J6.2 | J12.3 11.68,33.15 12.19,33.66 12.19,48.13 11.62,48.7
  Bottom 1.016: J5.4 32.38,69.22 26.8,69.22 20.52,69.22 J6.2
+CH1
  Top 0.203: 44.35,4.77 C7.1 | U3.4 44.89,6.42 R16.1
  Top 0.813: J2.1 44.45,4.53 C7.1 46.61,4.7 R16.1
+CH2
  Top 0.203: U4.4 36.63,6.67 R17.1
  Top 0.813: J2.3 38.61,3.7 R17.1 C9.1
+CH3
  Top 0.203: U5.4 28.89,6.54 R18.1
  Top 0.813: J2.5 30.45,4.41 R18.1 28.16,4.7 C10.1
+CH4
  Top 0.203: U6.4 20.76,6.54 R23.1
  Top 0.813: R23.1 22.35,4.57 21.97,4.19 | 21.97,4.19 J1.1 20.15,2.71 | C13.1 21.34,4.83 21.97,4.19
+CH5
  Top 0.203: U7.4 12.76,6.42 R24.1
  Top 0.813: C15.1 R24.1 14.48,3.7 J1.3
+CH6
  Top 0.203: U8.4 6.67,10.61 7.37,9.91 7.37,8.38 7.62,8.13 7.62,6.73 R25.1
  Top 0.813: J1.5 6.32,4.47 R25.1 5.08,4.82 3.21,6.69 C17.1
-CH1  (via drill 0.61)
  Top 0.813: C7.2 41.95,3.54 J2.2 | v40.01,11.05 40.64,11.68 40.64,14.73 41.97,16.07 L1.1
  Bottom 0.813: v40.01,11.05 40.89,10.16 40.89,7.24 40.77,7.11 40.77,2.72 J2.2
-CH2  (via drill 0.61)
  Top 0.813: L2.1 33.84,16.32 v32.51,14.99 | C9.2 34.08,2.67 J2.4
  Bottom 0.813: v32.51,14.99 33.78,13.72 33.78,7.87 33.02,7.11 33.02,3.47 J2.4
-CH3  (via drill 0.61)
  Top 0.813: J2.6 26.95,3.15 26.07,4.03 C10.2 | L3.1 25.72,16.57 v23.88,14.73
  Bottom 0.813: v23.88,14.73 23.88,12.83 26.54,10.16 26.54,8.64 24.64,6.73 24.64,4.85 J2.6
-CH4  (via drill 0.61)
  Top 0.813: L4.1 18.41,18.16 v19.18,17.4 | C13.2 18.33,4.05 J1.2
  Bottom 0.813: v19.18,17.4 18.16,16.38 18.16,10.29 21.08,7.37 21.08,5.08 20.45,4.45 18.73,4.45 J1.2
-CH5  (via drill 0.61)
  Top 0.813: L5.1 v9.4,18.16 | C15.2 9.82,3.18 J1.4
  Bottom 0.813: v9.4,18.16 9.78,17.78 9.78,9.27 8.64,8.13 8.64,4.57 9.78,3.43 9.78,2.58 J1.4
-CH6  (via drill 0.61)
  Top 0.813: J1.6 2.82,4.51 C17.2 | v4.45,25.65 5.21,25.65 5.46,25.4 11.68,25.4 13.59,27.3 15.11,27.3 15.81,28 L6.1
  Bottom 0.813: v4.45,25.65 2.41,23.62 2.41,6.73 3.05,6.1 3.05,2.77 J1.6
ADC0  (via drill 0.33)
  Top 0.203: U9.23 51.69,56.42 51.69,57.66 51.18,58.17 49.66,58.17 48.9,57.4 v48.9,57.28 | v60.07,61.85 57.02,61.85 56.01,62.87 50.16,62.87 48.9,61.59 v48.9,60.96 | v65.15,40.26 63.97,39.08 R19.2 | C18.1 47.5,69.47 46.99,69.98 J4.1
  Bottom 0.203: v48.9,57.28 v48.9,60.96 48.9,61.59 49.66,62.36 49.66,69.09 48.26,70.48 48.26,70.87 48.01,71.12 J4.1 | v60.07,61.85 60.33,61.59 60.33,58.04 62.1,56.26 63.5,56.26 67.44,52.32 67.44,42.55 v65.15,40.26
ADC1  (via drill 0.33)
  Top 0.203: U9.24 49.78,56.24 49.78,57.02 v50.04,57.28 | v59.31,60.96 56.9,60.96 55.75,62.1 50.67,62.1 v50.04,61.47 | R20.2 58.71,38.01 60.07,39.37 60.33,39.37 v60.58,39.62 | J4.2 49.53,70.23 C19.1
  Bottom 0.203: v50.04,57.28 v50.04,61.47 50.29,61.72 50.29,70.36 J4.2 | v59.31,60.96 59.56,60.71 59.56,57.66 61.85,55.37 63.12,55.37 66.67,51.82 66.67,43.05 63.88,40.26 61.21,40.26 v60.58,39.62
ADC2  (via drill 0.33)
  Top 0.203: v51.82,58.8 49.15,58.8 48.01,57.66 48.01,55.98 U9.25 48.9,55.01 v48.9,54.36 | C25.1 52.7,70.48 J4.3 | v56.13,26.67 57.7,26.67 R28.1
  Bottom 0.203: v51.82,58.8 50.93,59.69 50.93,70.87 51.18,71.12 J4.3 | v48.9,54.36 48.9,53.09 48.64,52.83 48.64,47.88 49.02,47.5 49.02,34.54 50.04,33.53 50.04,31.24 54.61,26.67 v56.13,26.67
ADC3  (via drill 0.33)
  Top 0.203: v52.45,59.82 51.31,59.82 50.93,59.44 48.9,59.44 46.86,57.4 46.86,55.91 U9.26 48.01,54.77 v48.01,53.47 | C24.1 54.99,70.74 J4.4 | v56.39,25.53 58.71,25.53 R26.1 58.42,24.47 58.42,21.72 59.31,20.83 60.58,20.83 61.59,19.81 R27.2
  Bottom 0.203: v52.45,59.82 51.94,59.82 51.56,60.2 51.56,68.71 53.34,70.48 53.34,70.74 53.72,71.12 J4.4 | v48.01,53.47 48.01,47.62 48.39,47.24 48.39,34.29 49.4,33.27 49.4,30.86 54.74,25.53 v56.39,25.53
ADC6  (via drill 0.33)
  Top 0.203: U9.19 57.45,57.66 | 57.45,57.66 58.17,57.66 59.69,59.18 59.94,59.18 61.72,60.96 v63.12,60.96 | v57.4,62.74 56.39,63.75 54.23,63.75 53.34,64.64 52.58,64.64 52.07,64.14 49.53,64.14 46.61,61.21 38.99,61.21 37,59.35 C5.1 | 57.45,57.66 57.45,57.87 v57.4,57.91 | C5.1 36.45,58.93 | R6.1 28.32,59.82 29.59,58.55 35.81,58.55 36.45,59.18 C5.1
  Bottom 0.203: v63.12,60.96 62.87,61.21 62.87,62.61 65.02,64.77 65.02,67.18 62.23,69.98 J4.7 | v57.4,62.74 v57.4,57.91
ADC7  (via drill 0.33)
  Top 0.203: U9.22 52.83,56.43 v52.83,58.17 | v60.07,68.96 60.33,68.96 60.83,69.47 63.63,69.47 | 63.63,69.47 64.39,69.47 64.77,69.85 J4.8 | v52.96,63.75 52.7,63.5 49.78,63.5 46.86,60.58 39.88,60.58 39.62,60.33 39.62,59.05 38.61,58.04 38.1,58.04 37.34,57.28 28.57,57.28 | 28.57,57.28 28.19,57.28 27.05,56.13 26.8,56.13 26.42,55.75 22.99,55.75 22.48,56.26 22.19,56.26 R3.1 | R4.2 28.61,57.11 28.57,57.28 | C3.1 63.63,69.47
  Bottom 0.203: v52.83,58.17 53.47,58.8 53.47,60.07 52.2,61.34 52.2,63.75 | 52.2,63.75 52.2,68.33 53.59,69.72 55.12,69.72 55.75,69.09 59.94,69.09 v60.07,68.96 | v52.96,63.75 52.2,63.75
AREF
  Top 0.254: U9.20 54.99,56.33 C28.1
ESD_NODE  (via drill 0.33)
  Top 0.203: v60.71,9.4 61.47,9.4 62.23,10.16 Q20.C 62.23,14.1 62.99,14.86 64.26,14.86 65.91,13.21 66.29,13.21 Q16.C Q10.C | v52.45,10.67 52.92,11.14 R13.2 52.92,13.93 C8.1
  Bottom 0.203: v52.45,10.67 52.45,8.76 53.21,8 59.31,8 v60.71,9.4
IO2  (via drill 0.33)
  Top 0.203: R7.1 31.15,67.78 v32.13,66.8 | Q9.1(G) 30.16,60.39 v30.99,59.56 30.93,59.63 | U9.32 43.03,52.96 42.16,52.96 39.24,50.04 34.42,50.04 33.91,49.53 33.91,48.13 v33.78,48.01 32.64,48.01 31.24,49.4 31.24,50.16 31.75,50.67 32.13,50.67 33.66,52.2 v34.67,52.2 | v49.28,28.32 45.97,28.32 45.47,28.83 43.81,28.83 42.93,29.72 42.16,29.72 40.64,31.24 39.5,31.24 38.73,30.48 36.83,30.48 35.43,29.08 v35.43,28.83
  Bottom 0.203: v33.78,48.01 33.78,46.74 33.27,46.23 33.27,35.43 35.69,33.02 35.69,29.08 v35.43,28.83 | v32.13,66.8 32.13,64.73 R10.1 | 30.48,63.08 R10.1 | v34.67,52.2 34.54,52.2 33.78,52.96 33.78,59.82 33.49,60.11 R8.1 R8.2 | R8.2 31.54,62.1 R10.1 | R8.2 31.54,60.11 v30.99,59.56 | J8.5 53.47,22.86 53.34,22.99 53.34,23.5 52.58,24.26 52.07,24.26 49.78,26.54 49.78,27.81 v49.28,28.32
IO3  (via drill 0.33)
  Top 0.203: 43.98,49.87 42.67,51.18 42.16,51.18 39.75,48.77 36.2,48.77 35.94,48.51 v35.56,48.51 | v37.21,29.46 37.47,29.72 38.86,29.72 39.37,30.23 40.64,30.23 41.91,28.96 42.8,28.96 43.69,28.07 45.21,28.07 45.72,27.56 48.64,27.56 v48.9,27.3 | J8.6 52.07,22.35 53.85,20.57 54.99,20.57 55.75,19.81 55.75,18.03 55.5,17.78 54.48,17.78 v54.36,17.65 | v42.93,5.97 42.48,6.42 U3.3
  Top 0.254: U9.1 43.98,49.87
  Bottom 0.203: v35.56,48.51 35.18,48.51 34.67,48.01 34.67,47.62 34.42,47.37 34.42,46.35 33.91,45.85 33.91,35.69 36.32,33.27 36.32,30.35 v37.21,29.46 | v48.9,27.3 48.9,26.54 52.07,23.37 J8.6 | v54.36,17.65 54.1,17.65 51.56,15.11 50.93,15.11 49.66,13.84 49.66,7.75 48.77,6.86 44.07,6.86 43.18,5.97 v42.93,5.97
IO4  (via drill 0.33)
  Top 0.203: U9.2 43.65,48.39 43.18,48.39 42.29,47.5 41.53,47.5 41.15,47.12 38.73,47.12 38.48,47.37 37.21,47.37 v35.31,45.47 | v34.92,35.94 35.18,35.94 36.32,34.8 38.73,34.8 39.12,34.42 41.91,34.42 43.43,32.89 44.2,32.89 45.09,32 47.12,32 v47.37,31.75 | Q14.1(G) 68.39,7.68 v68.07,8
  Bottom 0.203: v47.37,31.75 47.12,31.5 47.12,24.77 48.13,23.75 48.64,23.75 J8.7 50.16,22.23 50.16,21.84 51.44,20.57 61.85,20.57 62.36,20.07 62.36,10.79 65.15,8 v68.07,8 | v34.92,35.94 34.54,36.32 34.54,44.7 v35.31,45.47
IO5  (via drill 0.33)
  Top 0.203: U9.9 50.8,45.19 v50.8,44.45 | v51.05,39.24 50.55,39.24 49.53,38.23 49.53,36.96 48.26,35.69 47.12,35.69 v46.86,35.43 | J8.8 46.99,22.48 45.34,20.83 45.34,16.89 v44.83,16.38 | v35.05,5.97 34.35,6.67 U4.3
  Bottom 0.203: v50.8,44.45 51.05,44.2 v51.05,39.24 | J8.8 46.99,23.88 46.48,24.38 46.48,35.05 v46.86,35.43 | v44.83,16.38 44.07,15.62 37.97,15.62 35.56,13.21 35.56,9.53 36.2,8.89 36.2,7.11 v35.05,5.97
IO6  (via drill 0.33)
  Top 0.203: U9.10 51.94,45.18 v51.94,44.58 | v51.05,37.97 50.67,37.97 50.16,37.47 50.16,36.7 48.01,34.54 46.1,34.54 45.21,35.43 44.83,35.43 v44.45,35.81 | J8.9 45.47,22.86 45.72,22.61 45.72,22.1 45.34,21.72 44.7,21.08 44.7,17.78 v44.32,17.4 | v26.92,5.97 26.35,6.54 U5.3
  Bottom 0.203: J8.9 44.45,23.75 45.09,24.38 45.09,25.78 44.07,26.8 44.07,27.69 45.09,28.7 45.09,35.18 v44.45,35.81 | v51.94,44.58 51.94,44.32 51.69,44.07 51.69,39.88 52.07,39.5 52.07,38.99 v51.05,37.97 | v44.32,17.4 44.32,17.14 43.43,16.26 34.67,16.26 34.29,16.64 30.86,16.64 29.59,15.37 29.59,14.73 32.13,12.19 32.13,10.03 29.97,7.87 29.08,7.87 27.18,5.97 v26.92,5.97
IO7  (via drill 0.33)
  Top 0.203: U9.11 53.09,45.17 v53.09,44.7 | v45.09,36.96 47.75,36.96 48.26,37.47 48.26,38.86 50.93,41.53 53.09,41.53 v53.21,41.66 | Q15.1(G) 63.58,6.9 v63.37,7.11 | v48.64,21.46 48.77,21.59 50.16,21.59 50.8,22.23 50.8,23.5 51.56,24.26 51.56,24.77 50.8,25.53 43.94,25.53 v43.81,25.4
  Bottom 0.203: v53.09,44.7 53.09,44.2 53.47,43.81 53.47,43.05 53.21,42.8 v53.21,41.66 | J8.10 42.93,22.86 43.18,23.11 43.18,23.5 44.45,24.77 44.45,25.4 | 44.45,25.4 44.45,25.53 43.43,26.54 43.43,27.94 44.45,28.96 44.45,34.54 43.56,35.43 43.56,36.2 44.45,37.08 44.96,37.08 v45.09,36.96 | v63.37,7.11 63.12,7.37 63.12,9.14 61.47,10.79 61.47,19.43 60.96,19.94 51.05,19.94 49.53,21.46 v48.64,21.46 | v43.81,25.4 44.45,25.4
IO8  (via drill 0.33)
  Top 0.203: v53.34,40.51 52.96,40.51 52.58,40.89 51.18,40.89 48.9,38.61 48.9,37.21 48.01,36.32 46.48,36.32 46.23,36.07 v45.85,36.07 | U9.12 54.23,45.15 v54.23,44.96 | v44.96,27.18 44.83,27.18 44.58,27.43 43.43,27.43 42.55,28.32 41.66,28.32 40.39,29.59 39.62,29.59 39.12,29.08 38.35,29.08 38.1,28.83 v38.1,27.94 35.05,27.94 34.92,28.07 32,28.07 31.37,28.7 30.48,28.7 29.72,29.46 29.34,29.46 28.45,30.35 28.45,31.11 28.19,31.37 28.19,32.13 28.57,32.51 28.57,33.27 v28.32,33.53 | Q21.1(G) 58.61,9.08 v57.78,9.91 | Q3.1(G) 29.68,43.73 v30.48,42.93
  Bottom 0.203: v54.23,44.96 54.23,44.58 54.1,44.45 54.1,41.27 v53.34,40.51 | J9.10 37.85,27.69 v38.1,27.94 | v45.85,36.07 45.85,28.07 v44.96,27.18 45.72,26.42 45.72,22.23 46.35,21.59 47.24,21.59 48.26,20.57 49.53,20.57 50.8,19.3 60.33,19.3 60.83,18.8 60.83,11.43 60.33,10.92 58.8,10.92 v57.78,9.91 | v30.48,42.93 30.48,42.8 30.73,42.55 30.73,38.73 29.59,37.59 29.59,34.67 29.46,34.54 29.34,34.54 v28.32,33.53
IO9  (via drill 0.33)
  Top 0.203: U9.13 55.37,45.14 v55.37,44.83 | v51.18,36.83 48.26,33.91 45.85,33.91 44.96,34.8 44.2,34.8 42.67,36.32 40.13,36.32 39.75,36.7 38.48,36.7 38.1,37.08 37.72,37.08 v37.59,36.96 | v37.85,32.64 37.59,32.89 35.05,32.89 34.67,32.51 34.67,32.13 33.91,31.37 | 33.91,31.37 v33.91,30.73 | U6.3 17.72,6.54 v17.02,5.71 | v15.24,14.61 15.24,14.99 14.73,15.49 14.73,20.57 15.11,20.95 15.88,21.59 16.26,21.97 16.26,23.5 17.14,24.38 18.92,24.38 19.56,25.02 v19.94,25.02 | v19.94,34.8 20.19,35.05 29.84,35.05 30.1,34.8 30.86,34.8 32.13,33.53 32.13,32.89 33.4,31.62 33.66,31.62 33.91,31.37
  Bottom 0.203: v55.37,44.83 54.86,44.32 54.86,40.64 54.23,40.01 54.23,39.37 53.21,38.35 52.7,38.35 v51.18,36.83 | J9.9 34.16,22.86 34.04,22.99 34.04,23.62 33.53,24.13 33.53,29.59 33.91,29.97 v33.91,30.73 | v37.59,36.96 37.34,36.7 37.34,34.42 37.59,34.16 37.59,32.89 v37.85,32.64 | v17.02,5.71 16.38,6.35 16.38,12.83 15.24,13.97 v15.24,14.61 | v19.94,25.02 19.68,25.27 19.68,34.54 v19.94,34.8
MISO  (via drill 0.33)
  Top 0.203: U9.16 54.63,49.28 55.12,49.28 58.55,45.85 58.55,44.45 J10.1 | v57.02,35.43 56.58,34.99 Q19.1(G) 55.48,33.02 53.47,33.02 53.34,32.89 51.69,32.89 48.39,29.59 46.48,29.59 45.97,30.1 44.32,30.1 43.43,30.99 42.67,30.99 41.15,32.51 38.99,32.51 38.23,31.75 37.47,31.75 37.21,32 35.43,32 34.8,31.37 34.8,30.35 34.29,29.84 33.78,29.84 33.27,29.34 32.51,29.34 31.88,29.97 30.99,29.97 v29.97,30.99
  Bottom 0.203: J9.6 28.7,22.86 28.83,22.99 28.96,23.11 28.96,23.62 29.72,24.38 29.72,24.89 29.72,30.73 v29.97,30.99 | J10.1 58.93,43.18 58.29,42.55 57.28,42.55 56.77,42.04 56.77,40.39 57.28,39.88 57.28,38.48 56.77,37.97 56.77,35.69 v57.02,35.43
MOSI  (via drill 0.33)
  Top 0.203: v31.24,47.37 33.02,47.37 33.4,46.99 34.04,46.99 34.67,47.62 34.67,49.02 35.05,49.4 39.5,49.4 42.16,52.07 42.8,52.07 43.94,50.93 45.34,50.93 46.1,50.16 49.02,50.16 49.53,50.67 52.07,50.67 52.32,50.42 52.36,50.42 U9.15 56.9,45.88 57.24,45.88 v57.28,45.85 | v31.24,30.99 30.86,31.37 30.86,32.51 v30.61,32.77 30.48,32.89 30.23,32.89 28.7,34.42 20.83,34.42 20.32,33.91 14.48,33.91 13.21,32.64 13.21,29.84 12.7,29.34 9.02,29.34 v7.49,27.81 | U8.3 2.51,9.81 2.92,9.4 v4.32,9.4
  Bottom 0.203: v31.24,30.99 30.35,30.1 30.35,22.99 J9.7 | v31.24,47.37 31.37,47.24 31.37,33.15 30.99,32.77 v30.61,32.77 | v57.28,45.85 57.91,45.85 59.05,46.99 61.09,46.99 J10.4 | v4.32,9.4 4.57,9.65 4.57,10.79 4.95,11.18 4.95,12.19 4.06,13.08 4.06,22.61 6.86,25.4 6.86,27.18 v7.49,27.81
N$1
  Top 0.203: R28.2 60.16,28.56 Q22.2(S)
N$2
  Top 0.203: R9.2 43.14,68.22 Q8.1(G) 43.86,67.39 44.96,66.29 44.96,65.15 44.32,64.52 41.66,64.52 41.53,64.39 35.05,64.39 33.91,63.25 R11.1
N$3
  Top 0.406: U3.1 41.72,8.32 41.4,8.76
  Top 0.813: 41.4,8.76 41.4,10.79 42.29,11.68 42.29,12.7 42.42,12.83 D3.A 42.96,13.24 44.83,15.11 45.59,15.11 46.61,16.13 46.61,17.14 L1.2
N$4
  Top 0.203: R11.2 33.87,60.87 31.79,62.95 Q9.3(D)
N$5
  Top 0.203: Q7.C 14.35,56.55 R12.2
  Top 0.61: Q5.B 15.28,50.88 14.35,51.82 Q7.C
N$6
  Top 0.203: R2.2 16.07,52.11 Q7.E 15.3,55.56 15.94,56.2 Q6.B 15.94,57.85 16.89,58.8 Q6.C 16.89,59.31 18.54,60.96 18.54,61.59 18.61,61.66 Q4.1(G)
N$7
  Top 0.203: Q5.C 13.93,48.68 12.57,50.04 12.57,55.5 D2.A
N$8
  Top 0.203: R6.2 27.6,61.81 27.27,62.13 U1.1
N$9  (via drill 0.33)
  Top 0.203: Q22.3(D) 62.82,29.25 v63.5,28.57 | v64.01,12.45 63.5,12.45 63.18,12.13 Q20.E 63.18,9.59 62.1,8.51 59.56,8.51 | Q21.3(D) 59.56,9.56 60.96,10.96 Q20.B 61.21,11.03 61.21,13.84 61.59,14.22 R27.1
  Top 0.61: Q21.3(D) 59.56,8.51 59.56,6.1 58.55,5.08 55.5,5.08 54.1,3.68 54.1,3.43 53.98,3.3 J3.6
  Bottom 0.203: v63.5,28.57 63.88,28.57 67.94,24.51 67.94,11.18 67.56,10.79 65.66,10.79 v64.01,12.45
N$10
  Top 0.203: R2.1 17.18,54.06 18.54,52.7 18.54,51.56 17.78,50.8 16.89,50.8 15.88,49.78 14.5,49.78 Q5.E
  Top 0.61: Q5.E Q7.B
N$11
  Top 0.406: U6.1 17.75,8.54 17.27,9.02
  Top 0.813: 17.27,9.02 17.27,12.79 D6.A 17.14,12.83 19.68,15.37 20.83,15.37 21.65,16.32 L4.2
N$12  (via drill 0.33)
  Top 0.203: Q17.3(D) 60.58,36.96 v60.2,36.58 | Q16.E 67.24,10.86 v66.29,9.91 | Q16.B 65.34,10.86 v66.29,9.91 | Q15.3(D) 65.49,9.1 v66.29,9.91
  Top 0.61: Q15.3(D) 65.28,5.97 64.39,5.08 62.78,5.08 J3.4
  Bottom 0.203: v60.2,36.58 60.2,33.27 68.71,24.77 68.71,10.67 68.07,10.03 66.42,10.03 v66.29,9.91
N$13
  Top 0.203: R20.1 59.12,39.97 Q17.2(S)
N$14
  Top 0.203: R19.1 63.25,35.79 Q11.2(S)
N$15  (via drill 0.33)
  Top 0.203: Q11.3(D) 60.49,34.25 v61.34,33.4 | Q10.E 70.93,9.84 v70.48,9.4 | Q10.B 69.17,10.71 v70.48,9.4 | Q14.3(D) 69.93,8.85 v70.48,9.4
  Top 0.61: Q14.3(D) 69.34,5.84 68.58,5.08 68.07,5.08 67.24,4.25 J3.2
  Bottom 0.203: v61.34,33.4 61.34,33.02 69.34,25.02 69.34,10.54 v70.48,9.4
N$16
  Top 0.406: U4.1 33.75,8.92 33.66,9.02
  Top 0.813: 33.66,9.02 33.4,9.27 33.4,11.05 34.45,12.1 D4.A 34.54,12.83 38.55,16.83 L2.2
N$17
  Top 0.406: U7.1 9.49,8.29 9.02,8.76
  Top 0.813: 9.02,8.76 9.02,11.18 8.54,11.65 D7.A 8.64,12.83 12.26,16.45 L5.2
N$18
  Top 0.406: U5.1 25.75,8.54 25.27,9.02
  Top 0.813: L3.2 30.42,17.08 26.19,12.86 D5.A 26.16,12.79 26.16,11.81 25.27,10.92 25.27,9.02
N$19
  Top 0.203: R29.1 54.1,28.57 54.48,28.96 55.12,28.96 56.13,29.97 Q23.3(D)
N$20
  Top 0.203: R15.1 53.43,6.92 Q13.B
  Top 0.61: Q12.E Q13.B
N$21
  Top 0.203: 52.07,28.45 R14.1 53.21,29.55 53.21,30.99 53.59,31.37 53.59,31.5 54.02,31.92 Q19.3(D)
N$22  (1 unrouted)
  Top 0.813: 2.41,12.95 2.03,13.34 2.03,20.83 3.94,22.73 D8.A 4.99,24.13 12.19,24.13 14.1,26.04 16.89,26.04 18.03,27.18 19.68,27.18 20.51,28 L6.2
N$23  (via drill 0.33)
  Top 0.203: R14.2 52.07,25.65 53.34,24.38 53.34,22.23 54.1,21.46 55.63,21.46 56.64,20.45 56.64,17.4 v55.37,16.13 | 55.12,10.03 v55.37,10.29 54.78,9.7 Q12.B
  Top 0.61: Q13.C 53.83,8.38 Q12.B
  Bottom 0.203: v55.37,16.13 54.61,15.37 54.61,11.05 v55.37,10.29
N$24
  Top 0.813: D1.A 10.84,69.94 J7.3
N$25
  Top 0.203: C31.2 J12.6
N$28
  Top 0.203: R21.1 55.12,14.12 Q18.E
  Top 0.61: Q24.B 57.6,16.59 Q18.E
N$29
  Top 0.203: R29.2 54.1,25.4 55.88,23.62 55.88,22.23 56.64,21.46 57.78,21.46 58.55,20.7 Q24.C
  Top 0.61: Q18.B 58.61,16.32 58.55,16.38 Q24.C
N$32
  Top 0.203: D1.K 12.08,65.94 Q1.E
  Top 0.813: D1.K 11.94,63.77 Q2.2(S)
N$33  (via drill 0.33)
  Top 0.203: R1.2 26.96,46.57 v27.18,46.35 | v27.18,55.24 27.05,55.12 20.07,55.12 19.81,55.37 v19.3,55.37 | v15.62,63.25 15.16,63.71 Q2.1(G) 15.75,65.68 Q1.C 15.75,67.71 Q1.B
  Bottom 0.203: v27.18,46.35 25.53,48.01 25.53,51.56 25.91,51.94 25.91,54.1 v27.18,55.24 | v19.3,55.37 19.3,57.66 19.43,57.78 19.43,61.21 17.65,62.99 15.88,62.99 v15.62,63.25
N$34
  Top 0.203: Q3.3(D) 26,45.09 R1.1
N$115
  Top 0.203: U9.7 45.12,44.2 44.45,44.2 43.94,43.69 42.67,43.69 41.4,42.42 Y1.1 40.3,41.19 39.88,40.77 C29.2
N$116
  Top 0.203: U9.8 45.62,43.56 44.7,43.56 44.2,43.05 44.83,42.42 Y1.2 45.59,42.21 45.59,41.15 46.1,40.64 C30.2
POWER
  Top 0.813: 16.76,61.47 16.89,61.47 | Q2.3(D) 12.62,61.51 12.57,61.47
  Top 1.27: Q4.3(D) 17.44,62.02 16.89,61.47
  Top 1.422: J7.1 3.17,70.99 9.91,64.26 9.91,62.87 11.3,61.47 12.57,61.47 16.76,61.47
RX  (via drill 0.33)
  Top 0.203: U9.30 43.77,54.48 41.91,54.48 38.73,51.31 33.66,51.31 v32.13,49.78 | v53.59,35.05 53.59,34.16 52.96,33.53 51.44,33.53 48.13,30.23 46.74,30.23 46.23,30.73 44.58,30.73 43.69,31.62 42.93,31.62 41.4,33.15 38.61,33.15 38.23,33.53 34.8,33.53 v33.78,32.51 33.4,32.89 33.15,32.89 32.77,33.27 32.77,33.91 30.99,35.69 19.56,35.69 18.41,34.54 16,34.54 14.86,35.69 J12.4
  Bottom 0.203: J8.3 58.55,22.86 58.42,22.99 58.42,23.37 58.67,23.62 58.67,27.43 56.52,29.59 56.52,30.23 54.23,32.51 54.23,34.42 v53.59,35.05 | v32.13,49.78 32.13,46.99 32,46.86 32,33.02 32.51,32.51 v33.78,32.51
SCK  (via drill 0.33)
  Top 0.203: J10.3 59.31,46.23 59.05,46.23 55.37,49.91 55.37,51.31 54.7,51.98 U9.17 | 59.12,29.66 v59.31,29.84 58.49,29.02 Q23.1(G) 58.23,29.02 57.28,29.97 57.28,30.61 57.02,30.86 55.24,30.86 54.74,30.35 v54.74,29.84 | v29.08,31.75 29.08,30.61 29.59,30.1 29.97,30.1 30.73,29.34 31.62,29.34 32.26,28.7 33.53,28.7 34.04,29.21 34.54,29.21 36.45,31.11 38.48,31.11 39.24,31.88 40.89,31.88 42.42,30.35 43.18,30.35 44.07,29.46 45.72,29.46 46.23,28.96 48.64,28.96 51.94,32.26 52.45,32.26 v52.7,32
  Bottom 0.203: J10.3 58.67,45.72 56.13,43.18 56.13,40.01 56.64,39.5 56.64,38.73 56.13,38.23 56.13,33.4 59.31,30.23 v59.31,29.84 | v29.08,31.75 29.08,25.15 28.19,24.26 27.18,24.26 26.42,23.5 26.42,23.11 26.16,22.86 J9.5 | v52.7,32 52.96,32 54.23,30.73 54.23,30.35 v54.74,29.84
SCL  (via drill 0.33)
  Top 0.203: U9.28 45.21,55.3 45.21,56.9 44.7,57.4 41.4,57.4 39.24,55.24 33.27,55.24 31.11,53.09 23.5,53.09 19.18,48.77 19.18,47.75 18.41,46.99 17.78,46.99 v17.53,46.74 17.27,46.48 16.89,46.48 16.38,45.97 11.68,45.97 J11.1
  Bottom 0.203: v17.53,46.74 17.91,46.74 18.41,46.23 18.41,25.65 16.26,23.5 16.26,23.11 16,22.86 J9.1
SDA  (via drill 0.33)
  Top 0.203: 17.72,48.2 23.24,53.72 30.86,53.72 33.02,55.88 38.73,55.88 40.89,58.04 45.47,58.04 45.97,57.53 45.97,55.67 U9.27 | 17.72,48.2 16.22,46.7 J11.2 | v18.03,47.88 17.72,48.2
  Bottom 0.203: J9.2 17.53,23.88 19.05,25.4 19.05,46.86 v18.03,47.88
SHLD_VIN
  Top 1.016: Q8.3(D) 46.06,67.61 44.7,68.96 44.7,69.98 43.56,71.12 J5.1
TX  (via drill 0.33)
  Top 0.203: U9.31 43.53,53.59 43.31,53.59 43.18,53.72 42.04,53.72 38.99,50.67 33.91,50.67 33.27,50.04 33.27,49.15 v33.02,48.9 | v52.58,34.42 52.32,34.16 51.18,34.16 47.88,30.86 46.99,30.86 46.48,31.37 44.83,31.37 43.94,32.26 43.18,32.26 41.66,33.78 38.86,33.78 38.48,34.16 35.94,34.16 35.56,34.54 34.42,34.54 v33.66,33.78 33.66,34.04 31.37,36.32 19.3,36.32 18.16,35.18 16.26,35.18 15.11,36.32 11.94,36.32 11.3,36.96 10.79,36.96 10.67,37.08 J12.5
  Bottom 0.203: v33.66,33.78 33.66,34.16 32.64,35.18 32.64,46.61 32.89,46.86 32.89,48.77 v33.02,48.9 | J8.4 57.15,23.11 58.04,24 58.04,27.18 55.88,29.34 55.88,29.97 53.59,32.26 53.59,33.4 v52.58,34.42
VIN  (via drill 0.33, 0.61, 0.8)
  Top 0.203: R9.1 41.19,67.78 U2.1 | U1.4 23.34,59.53 v23.11,59.31 | R5.1 25.4,66.68 25.53,66.8 v26.92,66.8 | 51.39,5.8 R15.2 51.34,5.84 | Q24.E 59.5,14.92 59.18,14.61 57.02,14.61 56.64,14.22 56.64,13.21 55.41,11.98 R21.2 52.92,9.78 Q13.E 52.85,9.4 51.82,9.4 51.31,9.91 | C11.1 51.34,5.84 | 50.97,12.28 R13.1 50.97,10.25 51.31,9.91 | U4.5 36.35,9.55 C14.1 | C12.1 44.96,8.92 U3.5 | 51.34,5.84 51.34,7.2 51.05,7.49 50.04,7.49 49.66,7.87 49.66,8.89 50.04,9.27 50.67,9.27 51.31,9.91 | U8.5 5.11,12.86 5.59,13.34 C23.1 | U5.5 28.35,8.67 28.83,9.14 C16.1 | U7.5 12.1,8.67 12.45,9.02 C22.1 | U6.5 20.35,8.54 20.83,9.02 C21.1
  Top 0.813: C12.1 44.96,10.03 45.85,10.92 | 45.85,10.92 46.83,11.91 D3.K 46.45,12.92 46.96,12.92 | C11.1 47.88,7.37 R16.2 46.74,9.27 v46.48,9.53 46.48,10.29 45.85,10.92 | R17.2 38.61,8.89 v38.23,9.27 38.23,10.41 37.72,10.92 | D4.K 38.45,11.65 37.72,10.92 | 37.72,10.92 C14.1 | R25.2 6.1,7.75 6.35,8 v6.35,9.53 | D8.K 4.19,20.19 4.19,20.45 6.48,22.73 v7.37,22.73 | R18.2 30.73,10.29 v30.35,10.67 | D5.K 30.19,10.83 v30.35,10.67 | C16.1 29.72,10.03 v30.35,10.67 | D6.K 21.3,11.72 21.97,10.92 21.97,10.03 | 21.97,10.03 21.97,9.53 v22.23,9.27 22.73,8.76 R23.2 | C21.1 21.97,10.03 | R24.2 14.48,8.76 v13.84,9.4 13.84,9.91 | D7.K 12.54,11.97 13.84,10.67 13.84,9.91 | C22.1 13.84,9.91 | C23.1 5.59,15.75 v5.71,15.88 | C20.1 v22.35,47.88
  Top 1.016: U2.1 41.91,66.29 41.78,66.17 | 41.78,66.17 41.02,65.41 34.67,65.41 33.91,64.64 v26.92,64.64 | Q8.2(S) 41.78,65.6 41.78,66.17
  Top 1.422: R5.1 v26.92,64.64
  Bottom 0.203: v23.11,59.31 23.11,65.53 24.38,66.8 v26.92,66.8
  Bottom 0.813: v38.23,9.27 37.72,9.78 37.72,12.57 38.48,13.34 47.24,13.34 | v30.35,10.67 27.56,13.08 27.56,19.81 | v6.35,9.53 6.35,10.54 6.86,11.05 6.86,15.88 | 6.86,15.88 6.86,18.8 8.64,20.57 | 11.3,20.57 8.64,20.57 | 8.64,20.57 8.64,21.46 v7.37,22.73 | v22.23,9.27 20.83,10.67 20.83,15.37 22.1,16.64 22.1,19.81 | v13.84,9.4 12.7,10.54 12.7,12.45 11.81,13.34 11.81,15.49 12.7,16.38 12.7,19.3 | v5.71,15.88 6.86,15.88 | v22.35,47.88 18.67,51.56
  Bottom 1.422: v28.45,64.64 v26.92,64.64 26.04,63.75 26.04,58.93 18.67,51.56 14.61,47.5 14.61,27.94 11.3,24.64 11.3,20.57 12.57,19.43 12.7,19.3 17.65,19.3 18.16,19.81 22.1,19.81 27.56,19.81 45.21,19.81 47.24,17.78 47.24,13.34 47.24,10.29 v46.48,9.53
VIN_S  (via drill 0.33)
  Top 0.203: U1.3 24.1,62.13 23.17,63.06 23.17,65.6 R5.2 | Q6.E 19.43,57.07 R3.2 19.6,57.57 v20.32,58.29 | v20.07,64.9 20.89,64.07 20.89,63.82
  Top 0.813: Q4.2(S) 20.64,63.56 20.89,63.82 | C2.1 21.08,66.55 22.1,65.66
  Top 1.016: C1.1 23.47,68.68 22.6,67.81 R5.2
  Top 1.422: 20.89,63.82 21.46,64.39 21.46,65.03 22.1,65.66 R5.2
  Bottom 0.203: v20.32,58.29 20.07,58.55 v20.07,64.9

### Text on the board
tPlace: RPUlux | RPUBUS.ORG
bPlace: IOREF | nRST | 5V | 0V | 0V | NC | NC | VIN | ADC3 | NC | NC | ADC6 | ADC7 | 0V | NC | PWR / 7..36V | 0V | 0V | 5V | 14 | ADC0 | ADC1 | 15 | 16 | ADC2 | ALT | 8_EN | SHIELD VIN IS / CNTRLD BY D2 (IO2) | 0V | 5V | SPI | 0V | !RESET | I2C | MOSI | SCK | IOREF | SCL | BOOTLOAD / PORT | MISO | !DTR! OR !RTS! | SDA | HOST_RX < TX | HOST_TX > RX | +5V | NC | 0V | NC | 0V | CS1_EN | CS0_EN | OC2A | OC1B | OC1A | ALT_EN/SINK_ADC2 | OC0A | OC0B | SINK_ADC0 | OC2B | SHLD_VIN_EN | SINK_ADC1 | SCL | SDA | NC | 0V | 13 | 12 | 11 | 10 | 9 | 8 | 7 | 6 | 5 | 4 | 3 | 2 | TX | RX | +5V | 0V | ANALOG | LED CC | LED CC | 16 | 14 | 17323^0 | 15 | RPUlux | 11 | RPUBUS.ORG | 8_SINK | 7_SINK | 4_SINK | 13_EN | 10 | 9 | 6 | 5 | 3 | 12_EN | OC2A | OC0B | OC2B | OC1B | OC1A | OC0A | CH6 | CH5 | CH4 | CH3 | CH2 | CH1 | - | - | - | ADC2 | 22mA | ADC1 | 0V | ADC0 | 22mA | + | - | + | + | + | - | + | - | +